# Altium project TCC.PrjPcb
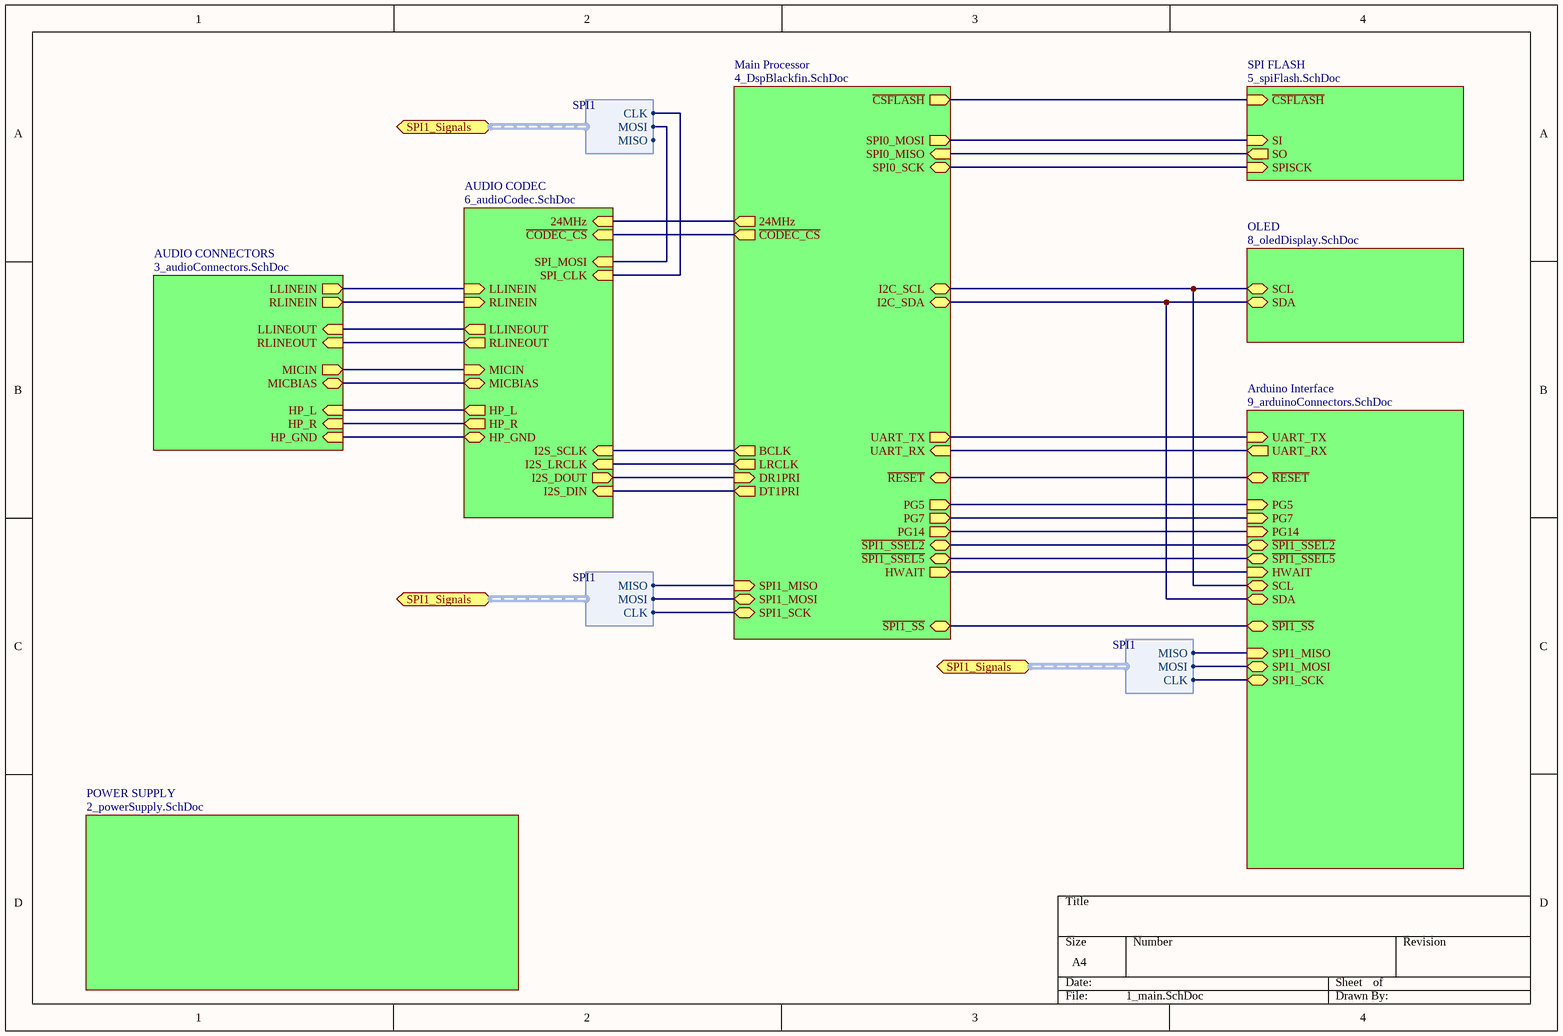
[diagram p0: 1_main.SchDoc]
8 sheets, 99 parts. Net scope: hierarchical (ports join the sheet entries above them; power ports are global).
Board file: PCB1.PcbDoc
Sheets:
  1_main.SchDoc
    Main Processor = 4_DspBlackfin.SchDoc
    SPI FLASH = 5_spiFlash.SchDoc
    OLED = 8_oledDisplay.SchDoc
    Arduino Interface = 9_arduinoConnectors.SchDoc
    AUDIO CODEC = 6_audioCodec.SchDoc
    AUDIO CONNECTORS = 3_audioConnectors.SchDoc
    POWER SUPPLY = 2_powerSupply.SchDoc

## Sheet 1_main.SchDoc
size A4

### Sub-sheets
Arduino Interface = 9_arduinoConnectors.SchDoc: PG7 (in), UART_TX (in), ~{SPI1_SS} (bidir), SPI1_SCK (bidir), ~{RESET} (bidir), ~{SPI1_SSEL5} (bidir), PG14 (in), PG5 (in), SPI1_MISO (in), SDA (bidir), SPI1_MOSI (bidir), ~{SPI1_SSEL2} (bidir), SCL (bidir), UART_RX (out), HWAIT (in)
AUDIO CODEC = 6_audioCodec.SchDoc: LLINEIN (in), LLINEOUT (out), RLINEIN (in), RLINEOUT (out), MICIN (in), MICBIAS (bidir), HP_R (out), HP_L (out), HP_GND (bidir), SPI_MOSI (in), SPI_CLK (in), I2S_DIN (in), I2S_SCLK (in), I2S_LRCLK (in), 24MHz (in), I2S_DOUT (out), ~{CODEC_CS} (in)
AUDIO CONNECTORS = 3_audioConnectors.SchDoc: LLINEIN (out), LLINEOUT (in), HP_R (in), RLINEOUT (in), HP_GND (in), MICIN (out), RLINEIN (out), HP_L (in), MICBIAS (bidir)
Main Processor = 4_DspBlackfin.SchDoc: SPI0_MISO (in), ~{CSFLASH} (out), SPI0_MOSI (out), SPI0_SCK (bidir), I2C_SDA (bidir), I2C_SCL (bidir), BCLK (out), DT1PRI (out), LRCLK (out), DR1PRI (in), SPI1_MOSI (bidir), SPI1_SCK (bidir), SPI1_MISO (in), 24MHz (out), ~{CODEC_CS} (out), UART_TX (out), UART_RX (in), ~{RESET} (bidir), ~{SPI1_SSEL5} (bidir), ~{SPI1_SSEL2} (bidir), PG5 (out), PG14 (out), PG7 (out), ~{SPI1_SS} (bidir), HWAIT (out)
OLED = 8_oledDisplay.SchDoc: SCL (bidir), SDA (bidir)
POWER SUPPLY = 2_powerSupply.SchDoc: no entries
SPI FLASH = 5_spiFlash.SchDoc: ~{CSFLASH} (in), SI (in), SO (out), SPISCK (in)

### Ports
SPI1_Signals (harness SPI1)

### Harnesses
SPI1: MISO, MOSI, CLK
SPI1: MOSI, CLK, MISO

### Nets
LLINEIN: sheet AUDIO CODEC/LLINEIN, sheet AUDIO CONNECTORS/LLINEIN
LLINEOUT: sheet AUDIO CODEC/LLINEOUT, sheet AUDIO CONNECTORS/LLINEOUT
RLINEIN: sheet AUDIO CODEC/RLINEIN, sheet AUDIO CONNECTORS/RLINEIN
RLINEOUT: sheet AUDIO CODEC/RLINEOUT, sheet AUDIO CONNECTORS/RLINEOUT
NetC14_2: sheet AUDIO CODEC/MICIN, sheet AUDIO CONNECTORS/MICIN
NetC15_2: sheet AUDIO CODEC/MICBIAS, sheet AUDIO CONNECTORS/MICBIAS
NetCN4_1: sheet AUDIO CODEC/HP_GND, sheet AUDIO CONNECTORS/HP_GND
NetCN4_3: sheet AUDIO CODEC/HP_R, sheet AUDIO CONNECTORS/HP_R
NetCN4_5: sheet AUDIO CODEC/HP_L, sheet AUDIO CONNECTORS/HP_L
NetCN7_3: sheet Main Processor/PG5, sheet Arduino Interface/PG5
NetCN7_4: sheet Main Processor/PG14, sheet Arduino Interface/PG14
NetCN7_5: sheet Main Processor/PG7, sheet Arduino Interface/PG7
NetCN8_1: sheet Main Processor/HWAIT, sheet Arduino Interface/HWAIT
NetP2_1: sheet Main Processor/I2C_SCL, sheet OLED/SCL, sheet Arduino Interface/SCL
NetP2_2: sheet Main Processor/I2C_SDA, sheet OLED/SDA, sheet Arduino Interface/SDA
NetP2_5: sheet Main Processor/SPI1_SCK, sheet Arduino Interface/SPI1_SCK, sheet AUDIO CODEC/SPI_CLK, port SPI1_Signals.CLK
NetP2_6: sheet Main Processor/SPI1_MISO, sheet Arduino Interface/SPI1_MISO, port SPI1_Signals.MISO
NetP2_7: sheet Main Processor/SPI1_MOSI, sheet Arduino Interface/SPI1_MOSI, sheet AUDIO CODEC/SPI_MOSI, port SPI1_Signals.MOSI
NetP2_8: sheet Main Processor/~{SPI1_SSEL2}, sheet Arduino Interface/~{SPI1_SSEL2}
NetP2_9: sheet Main Processor/~{SPI1_SSEL5}, sheet Arduino Interface/~{SPI1_SSEL5}
NetP2_10: sheet Main Processor/~{SPI1_SS}, sheet Arduino Interface/~{SPI1_SS}
NetR8_2: sheet Main Processor/24MHz, sheet AUDIO CODEC/24MHz
NetR21_1: sheet Main Processor/~{RESET}, sheet Arduino Interface/~{RESET}
NetR24_1: sheet Main Processor/SPI0_MISO, sheet SPI FLASH/SO
NetR25_1: sheet Main Processor/~{CSFLASH}, sheet SPI FLASH/~{CSFLASH}
NetR26_2: sheet Main Processor/SPI0_SCK, sheet SPI FLASH/SPISCK
NetR31_2: sheet Main Processor/UART_RX, sheet Arduino Interface/UART_RX
NetR32_2: sheet Main Processor/UART_TX, sheet Arduino Interface/UART_TX
NetU3_1: sheet Main Processor/BCLK, sheet AUDIO CODEC/I2S_SCLK
NetU3_2: sheet Main Processor/LRCLK, sheet AUDIO CODEC/I2S_LRCLK
NetU3_5: sheet Main Processor/DT1PRI, sheet AUDIO CODEC/I2S_DIN
NetU3_11: sheet Main Processor/~{CODEC_CS}, sheet AUDIO CODEC/~{CODEC_CS}
NetU3_16: sheet Main Processor/SPI0_MOSI, sheet SPI FLASH/SI
NetU3_64: sheet Main Processor/DR1PRI, sheet AUDIO CODEC/I2S_DOUT

## Sheet 4_DspBlackfin.SchDoc
size A3; DocumentNumber: 6; SheetNumber: 6; SheetTotal: 8
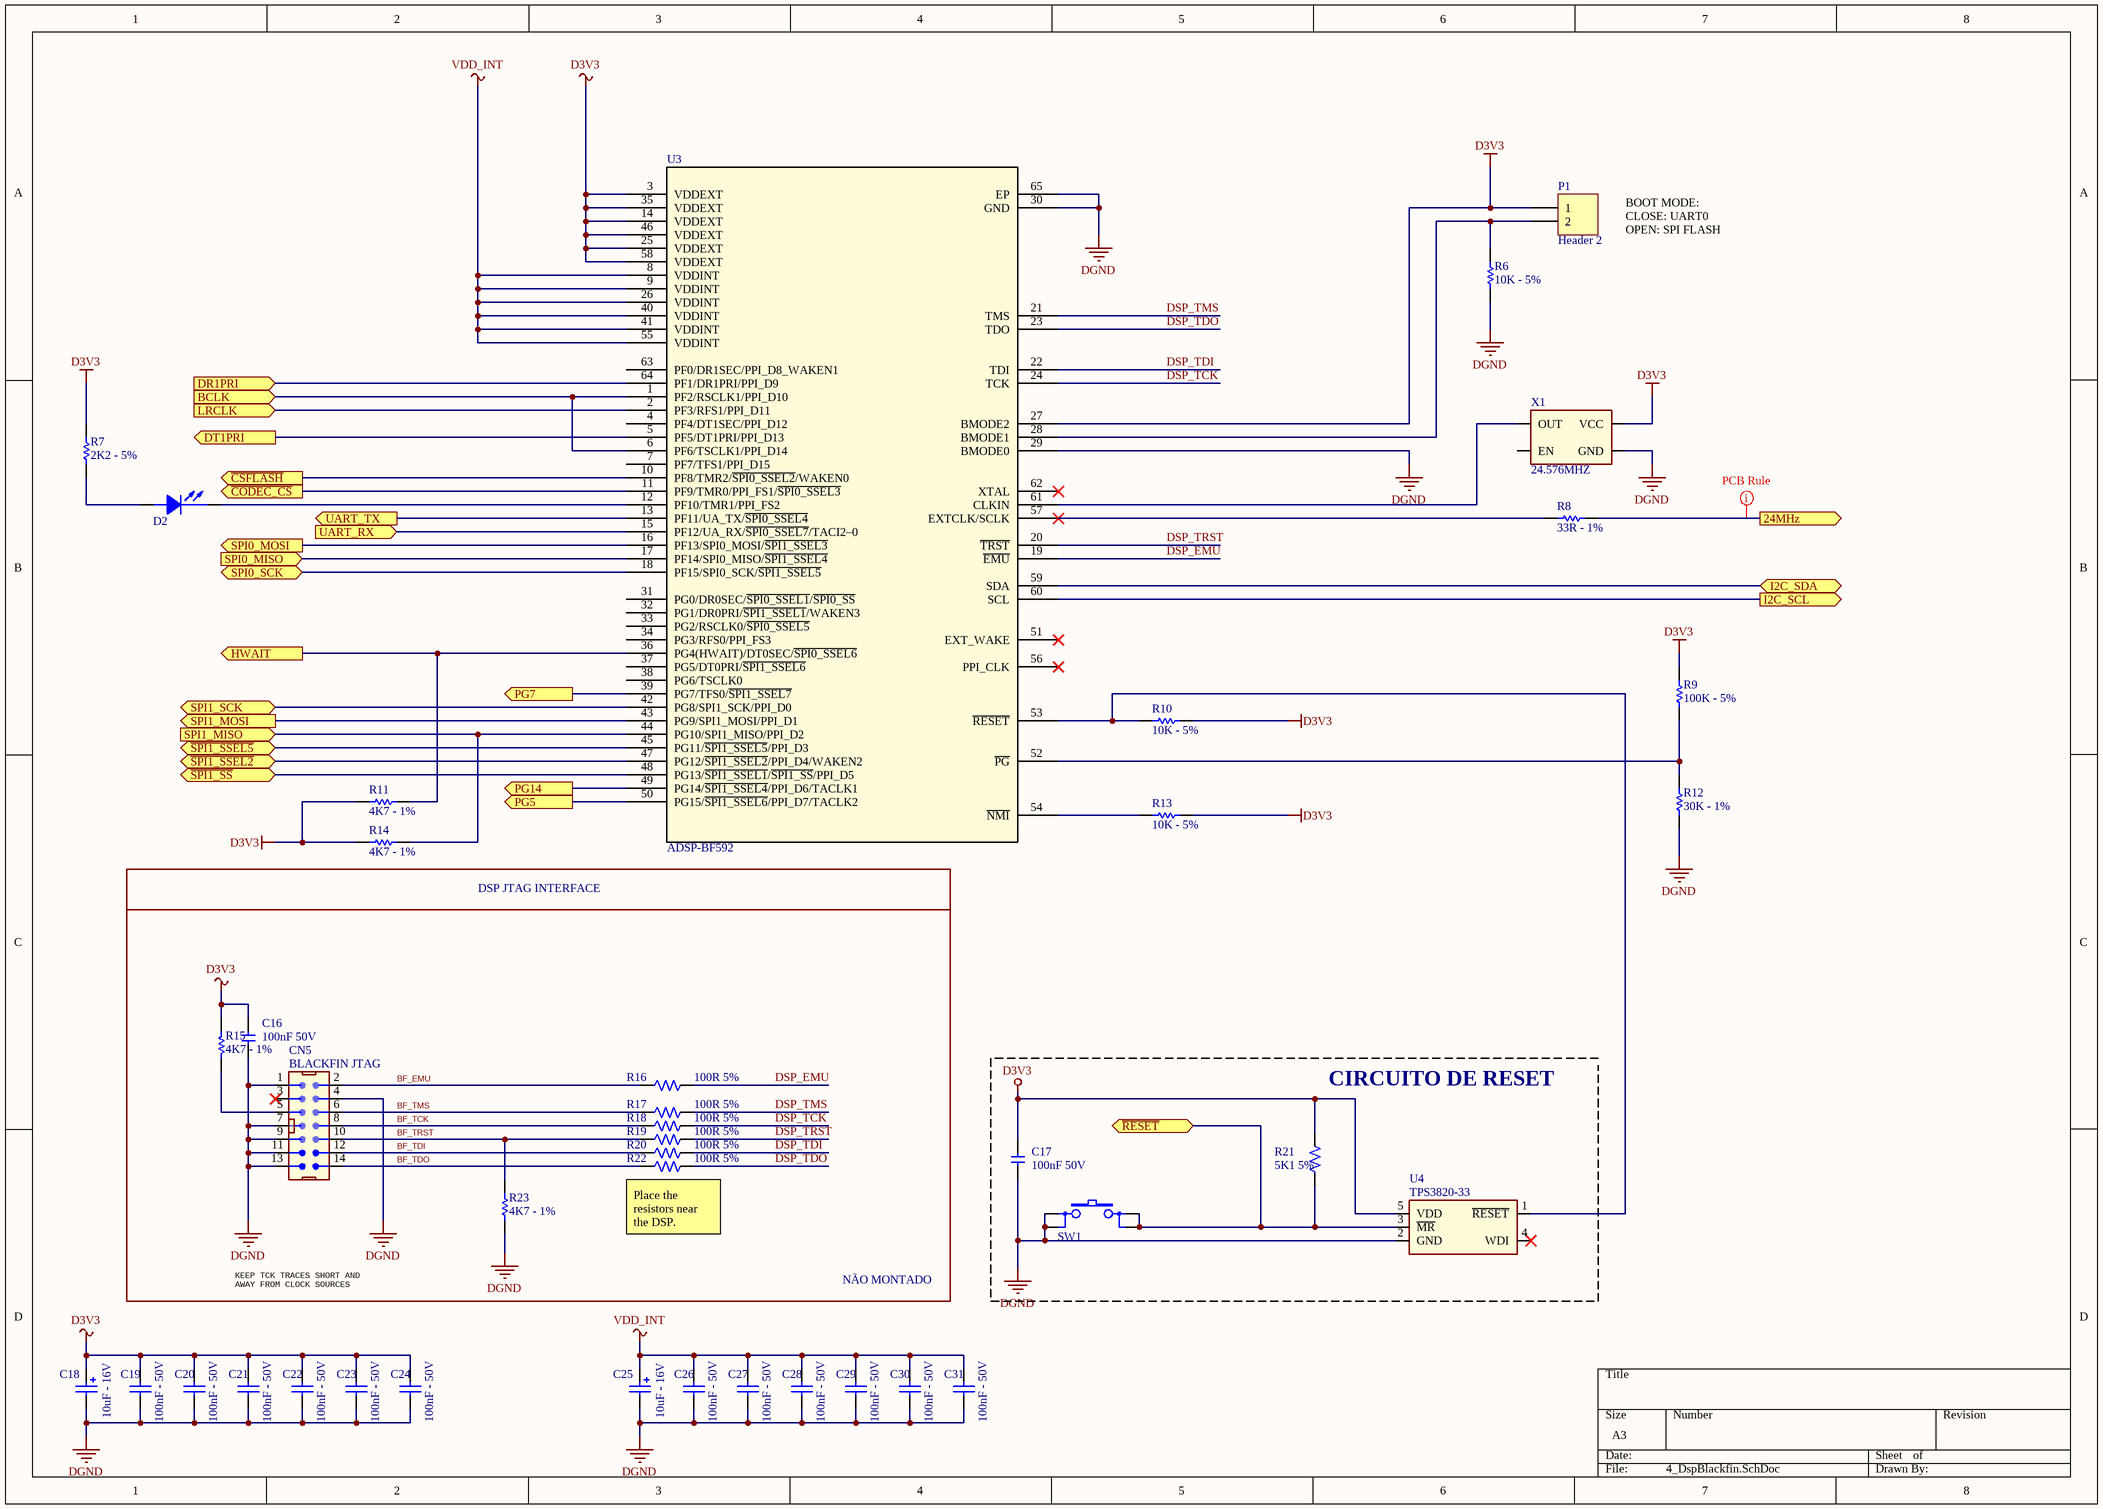
[diagram p1: 4_DspBlackfin.SchDoc]

### Parts
C16  100nF 50V  [SMD0805]
C17  100nF 50V  [SMD0805]
C18  VALOR: 10uF - 16V  [CAP/SMD/ELET/5MM/NP]  (hidden comment: Capacitor 10 uF - 20%)
C19  VALOR: 100nF - 50V  [SMD0805-CAP]  (hidden comment: Capacitor 100 nF - 10%)
C20  VALOR: 100nF - 50V  [SMD0805-CAP]  (hidden comment: Capacitor 100 nF - 10%)
C21  VALOR: 100nF - 50V  [SMD0805-CAP]  (hidden comment: Capacitor 100 nF - 10%)
C22  VALOR: 100nF - 50V  [SMD0805-CAP]  (hidden comment: Capacitor 100 nF - 10%)
C23  VALOR: 100nF - 50V  [SMD0805-CAP]  (hidden comment: Capacitor 100 nF - 10%)
C24  VALOR: 100nF - 50V  [SMD0805-CAP]  (hidden comment: Capacitor 100 nF - 10%)
C25  VALOR: 10uF - 16V  [CAP/SMD/ELET/5MM/NP]  (hidden comment: Capacitor 10 uF - 20%)
C26  VALOR: 100nF - 50V  [SMD0805-CAP]  (hidden comment: Capacitor 100 nF - 10%)
C27  VALOR: 100nF - 50V  [SMD0805-CAP]  (hidden comment: Capacitor 100 nF - 10%)
C28  VALOR: 100nF - 50V  [SMD0805-CAP]  (hidden comment: Capacitor 100 nF - 10%)
C29  VALOR: 100nF - 50V  [SMD0805-CAP]  (hidden comment: Capacitor 100 nF - 10%)
C30  VALOR: 100nF - 50V  [SMD0805-CAP]  (hidden comment: Capacitor 100 nF - 10%)
C31  VALOR: 100nF - 50V  [SMD0805-CAP]  (hidden comment: Capacitor 100 nF - 10%)
CN5  BLACKFIN JTAG  [WALCON.100/IDSC14/W.325/14]
D2  LED 2MM SMD AZUL  [LED\SMD1206]  (value not drawn)
P1  Header 2  [HDR1X2]
R6  VALOR: 10K - 5%  [SMD0805]  (hidden comment: 10K - 5% - 0805 - 328)
R7  VALOR: 2K2 - 5%  [SMD0805]  (hidden comment: 2K2 - 5% - 0805 - 333)
R8  VALOR: 33R - 1%  [SMD0805]  (hidden comment: 33R - 1% - 0805 - 406)
R9  VALOR: 100K - 5%  [SMD0805]  (hidden comment: 100K - 5% - 0805 - 326)
R10  VALOR: 10K - 5%  [SMD0805]  (hidden comment: 10K - 5% - 0805 - 328)
R11  VALOR: 4K7 - 1%  [SMD0805]  (hidden comment: 4K7 - 1% - 0805 - 438)
R12  VALOR: 30K - 1%  [SMD0805]  (hidden comment: 30K- 1% - 0805 - 400)
R13  VALOR: 10K - 5%  [SMD0805]  (hidden comment: 10K - 5% - 0805 - 328)
R14  VALOR: 4K7 - 1%  [SMD0805]  (hidden comment: 4K7 - 1% - 0805 - 438)
R15  VALOR: 4K7 - 1%  [SMD0805]  (hidden comment: 4K7 - 1% - 0805 - 438)
R16  100R 5%  [SMD0805]
R17  100R 5%  [SMD0805]
R18  100R 5%  [SMD0805]
R19  100R 5%  [SMD0805]
R20  100R 5%  [SMD0805]
R21  5K1 5%  [SMD0805]
R22  100R 5%  [SMD0805]
R23  VALOR: 4K7 - 1%  [SMD0805]  (hidden comment: 4K7 - 1% - 0805 - 438)
SW1  Switch TACT, 180G, 4 TERM, 6 X 6MM  [SW/TACT]  (value not drawn)
U3  ADSP-BF592  [CP_64_4]
U4  TPS3820-33  [DBV.95M/5/WG3.00/L3.00]
X1  VALOR: 24.576MHZ  [CRYSTAL/SMD/5X7]  (hidden comment: Crystal 24.576MHZ)

### Ports
24MHz (out), BCLK (in), DR1PRI (in), DT1PRI (out), HWAIT (out), I2C_SCL (out), I2C_SDA (bidir), LRCLK (in), PG5 (out), PG7 (out), PG14 (out), SPI0_MISO (in), SPI0_MOSI (out), SPI0_SCK (bidir), SPI1_MISO (in), SPI1_MOSI (out), SPI1_SCK (bidir), UART_RX (in), UART_TX (out), ~{CODEC_CS} (out), ~{CSFLASH} (out), ~{RESET} (bidir), ~{SPI1_SSEL2} (bidir), ~{SPI1_SSEL5} (bidir), ~{SPI1_SS} (bidir)

### Nets
D3V3: C16.2 C17.2 C18.1 C19.2 C20.1 C21.1 C22.2 C23.2 C24.2 P1.1 R7.2 R9.2 R10.2 R11.2 R13.2 R14.2 R15.2 R21.2 U3.3(VDDEXT) U3.14(VDDEXT) U3.25(VDDEXT) U3.27(BMODE2) U3.35(VDDEXT) U3.46(VDDEXT) U3.58(VDDEXT) U4.5(VDD) X1.4(VCC)
DGND: C16.1 C17.1 C18.2 C19.1 C20.2 C21.2 C22.1 C23.1 C24.1 C25.2 C26.1 C27.2 C28.2 C29.1 C30.1 C31.1 CN5.1 CN5.4 CN5.7 CN5.9 CN5.11 CN5.13 R6.1 R12.1 R23.1 SW1.1 SW1.2 U3.29(BMODE0) U3.30(GND) U3.65(EP) U4.2(GND) X1.2(GND)
VDD_INT: C25.1 C26.2 C27.1 C28.1 C29.2 C30.2 C31.2 U3.8(VDDINT) U3.9(VDDINT) U3.26(VDDINT) U3.40(VDDINT) U3.41(VDDINT) U3.55(VDDINT)
BF_EMU: CN5.2 R16.1
BF_TCK: CN5.8 R18.1
BF_TDI: CN5.12 R20.1
BF_TDO: CN5.14 R22.1
BF_TMS: CN5.6 R17.1
BF_TRST: CN5.10 R19.1 R23.2
DSP_EMU: R16.2 U3.19(~{EMU})
DSP_TCK: R18.2 U3.24(TCK)
DSP_TDI: R20.2 U3.22(TDI)
DSP_TDO: R22.2 U3.23(TDO)
DSP_TMS: R17.2 U3.21(TMS)
DSP_TRST: R19.2 U3.20(~{TRST})
NetCN5_5: CN5.5 R15.1
NetCN7_3: U3.50(PG15/~{SPI1_SSEL6}/PPI_D7/TACLK2) ; port PG5
NetCN7_4: U3.49(PG14/~{SPI1_SSEL4}/PPI_D6/TACLK1) ; port PG14
NetCN7_5: U3.39(PG7/TFS0/~{SPI1_SSEL7}) ; port PG7
NetCN8_1: R11.1 U3.36(PG4(HWAIT)/DT0SEC/~{SPI0_SSEL6}) ; port HWAIT
NetD2_1: D2.1(ANODE) R7.1
NetD2_2: D2.2(CATHODE) U3.12(PF10/TMR1/PPI_FS2)
NetP1_2: P1.2 R6.2 U3.28(BMODE1)
NetP2_1: U3.60(SCL) ; port I2C_SCL
NetP2_2: U3.59(SDA) ; port I2C_SDA
NetP2_5: U3.42(PG8/SPI1_SCK/PPI_D0) ; port SPI1_SCK
NetP2_6: R14.1 U3.44(PG10/SPI1_MISO/PPI_D2) ; port SPI1_MISO
NetP2_7: U3.43(PG9/SPI1_MOSI/PPI_D1) ; port SPI1_MOSI
NetP2_8: U3.47(PG12/~{SPI1_SSEL2}/PPI_D4/WAKEN2) ; port ~{SPI1_SSEL2}
NetP2_9: U3.45(PG11/~{SPI1_SSEL5}/PPI_D3) ; port ~{SPI1_SSEL5}
NetP2_10: U3.48(PG13/~{SPI1_SSEL1}/~{SPI1_SS}/PPI_D5) ; port ~{SPI1_SS}
NetR8_1: R8.1 U3.57(EXTCLK/SCLK)
NetR8_2: R8.2 ; port 24MHz
NetR9_1: R9.1 R12.2 U3.52(~{PG})
NetR10_1: R10.1 U3.53(~{RESET}) U4.1(~{RESET})
NetR13_1: R13.1 U3.54(~{NMI})
NetR21_1: R21.1 SW1.3 SW1.4 U4.3(~{MR}) ; port ~{RESET}
NetR24_1: U3.17(PF14/SPI0_MISO/~{SPI1_SSEL4}) ; port SPI0_MISO
NetR25_1: U3.10(PF8/TMR2/~{SPI0_SSEL2}/WAKEN0) ; port ~{CSFLASH}
NetR26_2: U3.18(PF15/SPI0_SCK/~{SPI1_SSEL5}) ; port SPI0_SCK
NetR31_2: U3.15(PF12/UA_RX/~{SPI0_SSEL7}/TACI2–0) ; port UART_RX
NetR32_2: U3.13(PF11/UA_TX/~{SPI0_SSEL4}) ; port UART_TX
NetU3_1: U3.1(PF2/RSCLK1/PPI_D10) U3.6(PF6/TSCLK1/PPI_D14) ; port BCLK
NetU3_2: U3.2(PF3/RFS1/PPI_D11) ; port LRCLK
NetU3_5: U3.5(PF5/DT1PRI/PPI_D13) ; port DT1PRI
NetU3_11: U3.11(PF9/TMR0/PPI_FS1/~{SPI0_SSEL3}) ; port ~{CODEC_CS}
NetU3_16: U3.16(PF13/SPI0_MOSI/~{SPI1_SSEL3}) ; port SPI0_MOSI
NetU3_61: U3.61(CLKIN) X1.3(OUT)
NetU3_64: U3.64(PF1/DR1PRI/PPI_D9) ; port DR1PRI

Not connected (* = marked no-connect by the designer): CN5 3*; U3 4(PF4/DT1SEC/PPI_D12) 7(PF7/TFS1/PPI_D15) 31(PG0/DR0SEC/~{SPI0_SSEL1}/~{SPI0_SS}) 32(PG1/DR0PRI/~{SPI1_SSEL1}/WAKEN3) 33(PG2/RSCLK0/~{SPI0_SSEL5}) 34(PG3/RFS0/PPI_FS3) 37(PG5/DT0PRI/~{SPI1_SSEL6}) 38(PG6/TSCLK0) 51(EXT_WAKE)* 56(PPI_CLK)* 62(XTAL)* 63(PF0/DR1SEC/PPI_D8_WAKEN1); U4 4(WDI)*; X1 1(EN)

### Layout directives
rule Undefined; Impedance: 50: NetR8_2

### Notes on the sheet
- BOOT MODE:
  CLOSE: UART0
  OPEN: SPI FLASH
- DSP JTAG INTERFACE
- CIRCUITO DE RESET
- (near R22) Place the resistors near the DSP.
- KEEP TCK TRACES SHORT AND
  AWAY FROM CLOCK SOURCES
- NÃO MONTADO

### Library data of the parts
C16 = 100nF 50V Z 0805 CCM 1760: MANUFACTURER: AVX; PARTNUMBER: 08055G104ZAT2A; CODE: 1760; DESC: CAP 100nF, 50V, SMD0805, Z%, Y5V, CERAMICO MULTICAMADA; VOLTAGE: CMAX; PSpiceTemplate: C^@REFDES %1 %2 ?TOLERANCE|C^@REFDES| @VALUE ?IC/IC=@IC/ ?TOLERANCE|\n.model C^@REFDES CAP C=1 DEV=@TOLERANCE%|; COMPSIDE: TOP; COMPLOC: [712.500,1512.500]; COMPROT: 90; COMPGROUP: 0; COMPFIXED: NO; COMPHEIGHT: 0.000; Value: 100nF 50V; COMPLOCKED: NO; COMPKEY: NO; DECOUPLER: NO; MEMORY: NO
C17 = 100nF 50V Z 0805 CCM 1760: MANUFACTURER: AVX; PARTNUMBER: 08055G104ZAT2A; CODE: 1760; DESC: CAP 100nF, 50V, SMD0805, Z%, Y5V, CERAMICO MULTICAMADA; VOLTAGE: CMAX; PSpiceTemplate: C^@REFDES %1 %2 ?TOLERANCE|C^@REFDES| @VALUE ?IC/IC=@IC/ ?TOLERANCE|\n.model C^@REFDES CAP C=1 DEV=@TOLERANCE%|; COMPSIDE: TOP; COMPLOC: [9537.500,4387.500]; COMPROT: 270; COMPGROUP: 0; COMPFIXED: NO; COMPHEIGHT: 0.000; Value: 100nF 50V; COMPLOCKED: NO; COMPKEY: NO; DECOUPLER: NO; MEMORY: NO
C18 C25 = 10uF - 16V - 20% - 5x11 - 3052: Capacitor 10uF, 20%, SMD 0805 5mm D x 5.8mm L; MANUFACTURER: NICHICON; PARTNUMBER: UUP1C100MCL1GS; CODIGO: 3052; EMBALAGEM: RELL; FORNECEDOR: VARIOS; DESC: CAP 10uF, 16V, C 5 X 11, ELCO SMD, NON POLARIZED; ComponentLink1Description: Datasheet; ComponentLink1URL: http://www.mouser.com/ds/2/293/e-up-27686.pdf; ComponentLink2Description: HOME NICHICON; ComponentLink2URL: http://nichicon-us.com/english/index.html; ENCAPSULAMENTO: CAP/SMD/ELET/5MM/NP; FACTORY PACK: 1000; LOCALIZAÇÃO: *; Supplier 1: Mouser; Supplier Part Number 1: 647-UUP1C100MCL1GS
C19-C24 C26-C31 = 100nF - 50V - 10% - 0805 - 580: Capacitor 100nF, 10%, SMD 0805; MANUFACTURER: AVX; PARTNUMBER: 08055C104KAT2A; CODIGO: 580; EMBALAGEM: REEL; FORNECEDOR: VARIOS; DESC: CAP 100nF, 50V, SMD0805, 10%, X7R, CERAMICO MULTICAMADA; TARGET MÁX U$: $0,0041; ComponentLink1Description: Datasheet; ComponentLink1URL: http://www.avx.com/docs/catalogs/cx7r.pdf; ComponentLink2Description: HOME AVX; ComponentLink2URL: http://www.avx.com/; ENCAPSULAMENTO: SMD0805; FACTORY PACK: 4000; LOCALIZAÇÃO: *; Supplier 1: Mouser; Supplier Part Number 1: 08055C104KAT2A; NCM: 8532.21.11
CN5 = IDC BOX HEADER 14P 762: PARTNUMBER: IDCSC-14; MANUFACTURER: METALTEX; DESC: CNC PCI, IDC BOX HEADER, 14P, 180G, SEM EJETOR; CODE: 762; COMPHEIGHT: 0.000; MEMORY: NO; COMPGROUP: 0; COMPROT: 270; COMPLOC: [212.500,1475.000]; COMPSIDE: TOP; DECOUPLER: NO; COMPKEY: NO; COMPLOCKED: NO; COMPFIXED: NO
D2 = LED 2MM SMD1206 AZUL - 3220: MANUFACTURER: DIALIGHT; PARTNUMBER: 598-8291-107F; DESC: LED 2MM, SMD1206, AZUL, 90MCD, 140G, DIFUSO; CODIGO: 3220; EMBALAGEM: REEL; ENCAPSULAMENTO: LED SMD; FORNECEDOR: MOUSER; ComponentLinK1Description: Datasheet; ComponentLink1URL: http://media.digikey.com/pdf/Data%20Sheets/Dialight%20PDFs/598_Series_1206_Pkg.pdf; ComponentLink2Description: HOME DIALIGHT; ComponentLink2URL: www.dialight.com; FACTORY PACK: 3000; LOCALIZAÇÃO: *; VALOR: LED 2MM SMD AZUL; Supplier Part Number 1: 645-598-8291-107F
P1 = Header 2: Header, 2-Pin; LatestRevisionDate: 17-Jul-2002; LatestRevisionNote: Re-released for DXP Platform.; Publisher: Altium Limited
R6 R10 R13 = 10K - 5% - 0805 - 328: Resistor 10K, 5%, SMD 0805; PARTNUMBER: RC2012J103CS; MANUFACTURER: SAMSUNG; CODIGO: 328; EMBALAGEM: REEL; FORNECEDOR: VARIOS; DESC: RES 10K, 5%, SMD 0805, MF; TARGET MÁX U$: $0.0012; ENCAPSULAMENTO: SMD0805; FACTORY PACK: 5000; ComponentLink1URL: http://media.digikey.com/pdf/Data%20Sheets/Samsung%20PDFs/CHIP_RESISTOR_Catalog.pdf; ComponentLink1Description: Datasheet; ComponentLink2Description: HOME SANSUNG; ComponentLink2URL: http://www.samsung.com/global/business/semiconductor/; Supplier 1: Digi-Key; Supplier Part Number 1: 1276-5552-1-ND; NCM: 8533.21.20
R7 = 2K2 - 5% - 0805 - 333: Resistor 2K2, 5%, SMD 0805; PARTNUMBER: RC2012J222CS; MANUFACTURER: SAMSUNG; CODIGO: 333; EMBALAGEM: REEL; FORNECEDOR: VARIOS; DESC: RES 2K2, 5%, SMD 0805, MF; TARGET MÁX U$: $0.0015; LOCALIZAÇÃO: *; ENCAPSULAMENTO: SMD0805; FACTORY PACK: 5000; Supplier 1: AVNET; Supplier Part Number 1: RC2012J222CS; ComponentLink1Description: Datasheet; ComponentLink1URL: http://download.siliconexpert.com/pdfs/2011/2/28/4/59/40/979/sam_/manual/resistor-general1.pdf; ComponentLink2Description: HOME SAMSUNG; ComponentLink2URL: http://www.samsung.com/global/business/semiconductor/; NCM: 8533.21.20
R8 = 33R - 1% - 0805 - 406: Resistor 33R 1%, SMD 0805; PARTNUMBER: RC2012F33R0CS; MANUFACTURER: SAMSUNG; CODIGO: 406; EMBALAGEM: REEL; FORNECEDOR: VARIOS; DESC: RES 33R, 1%, SMD 0805, MF; TARGET MÁX U$: $0.0015; LOCALIZAÇÃO: *; ENCAPSULAMENTO: SMD0805; FACTORY PACK: 5000; ComponentLink1Description: Datasheet; ComponentLink1URL: http://download.siliconexpert.com/pdfs/2013/2/17/18/59/11/464/koa_/manual/104rk73h.pdf; ComponentLink2Description: KOA Speer Electronics webpage; ComponentLink2URL: http://www.koaspeer.com/; Supplier 1: MOUSER; Supplier Part Number 1: RC2012F33R0CS; NCM: 8533.21.20
R9 = 100K - 5% - 0805 - 326: Resistor 100K, 5%, SMD 0805; PARTNUMBER: RC2012J104CS; MANUFACTURER: SAMSUNG; CODIGO: 326; EMBALAGEM: REEL; FORNECEDOR: VARIOS; DESC: RES 100K, 5%, SMD 0805, MF; TARGET MÁX U$: $0.0012; LOCALIZAÇÃO: *; ENCAPSULAMENTO: SMD0805; FACTORY PACK: 5000; ComponentLink1Description: Datasheet; ComponentLink1URL: http://media.digikey.com/pdf/Data%20Sheets/Samsung%20PDFs/CHIP_RESISTOR_Catalog.pdf; ComponentLink2Description: HOME SANSUNG; ComponentLink2URL: http://www.samsung.com/global/business/semiconductor/; Supplier 1: Digi-Key; Supplier Part Number 1: 1276-5576-1-ND; NCM: 8533.21.20
R11 R14 R23 = 4K7 - 1% - 0805 - 438: Resistor 4K7, 1%, SMD 0805; PARTNUMBER: RC2012F4701CS; MANUFACTURER: SAMSUNG; CODIGO: 438; EMBALAGEM: REEL; FORNECEDOR: VARIOS; DESC: RES 4K7, 1%, SMD 0805, MF; TARGET MÁX U$: $0.0015; LOCALIZAÇÃO: *; ENCAPSULAMENTO: SMD0805; FACTORY PACK: 5000; ComponentLink1Description: Datasheet; ComponentLink1URL: http://avnetexpress.avnet.com/store/em/EMController/_/A-5002847207733/An-0?action=part&catalogId=500201&langId=-1&storeId=500201&CMP=KNC-SupplyFrame_VSE-T11; ComponentLink2Description: HOME SAMSUNG; ComponentLink2URL: http://www.samsung.com/global/business/semiconductor/; Supplier 1: AVNET; Supplier Part Number 1: RC2012F4701CS; NCM: 8533.21.20
R12 = 30K - 1% - 0805 - 401: Resistor 30K, 1%, SMD 0805; PARTNUMBER: ERJ-6ENF3002V; MANUFACTURER: Vishay Dale; CODIGO: 401; EMBALAGEM: REEL; FORNECEDOR: VARIOS; DESC: RES 30K, 1%, SMD 0805, MF; TARGET MÁX U$: $0.0015; LOCALIZAÇÃO: *; ENCAPSULAMENTO: SMD0805; FACTORY PACK: 5000; ComponentLink1Description: Datasheet; ComponentLink1URL: http://www.vishay.com/docs/20035/dcrcwe3.pdf; ComponentLink2Description: Vishay Homepage; ComponentLink2URL: http://www.vishay.com/; Supplier 1: AVNET; Supplier Part Number 1: CRCW0805300RFKEA; NCM: 8533.21.20
R15 = 4K7 - 1% - 0805 - 438: Resistor 4K7, 1%, SMD 0805; PARTNUMBER: RC2012F4701CS; MANUFACTURER: SAMSUNG; DESC: RES 4K7, 1%, SMD 0805, MF; CODIGO: 438; EMBALAGEM: REEL; FORNECEDOR: VARIOS; TARGET MÁX U$: $0.0015; LOCALIZAÇÃO: *; ENCAPSULAMENTO: SMD0805; FACTORY PACK: 5000; ComponentLink1Description: Datasheet; ComponentLink1URL: http://avnetexpress.avnet.com/store/em/EMController/_/A-5002847207733/An-0?action=part&catalogId=500201&langId=-1&storeId=500201&CMP=KNC-SupplyFrame_VSE-T11; ComponentLink2Description: HOME SAMSUNG; ComponentLink2URL: http://www.samsung.com/global/business/semiconductor/; Supplier 1: AVNET; Supplier Part Number 1: RC2012F4701CS; NCM: 8533.21.20
R16 = 100R 5% 0805 327: MANUFACTURER: SAMSUNG; PARTNUMBER: RC2012J101CS; CODE: 327; DESC: RES 100R, 5%, SMD 0805, MF; COMPFIXED: NO; COMPGROUP: 0; COMPHEIGHT: 0.000; COMPLOC: [800.000,787.500]; COMPROT: 90; COMPSIDE: TOP; COMPKEY: NO; COMPLOCKED: NO; DECOUPLER: NO; MEMORY: NO
R17 = 100R 5% 0805 327: MANUFACTURER: SAMSUNG; PARTNUMBER: RC2012J101CS; CODE: 327; DESC: RES 100R, 5%, SMD 0805, MF; COMPFIXED: NO; COMPGROUP: 0; COMPHEIGHT: 0.000; COMPLOC: [875.000,887.500]; COMPROT: 270; COMPSIDE: TOP; COMPKEY: NO; COMPLOCKED: NO; DECOUPLER: NO; MEMORY: NO
R18 = 100R 5% 0805 327: MANUFACTURER: SAMSUNG; PARTNUMBER: RC2012J101CS; CODE: 327; DESC: RES 100R, 5%, SMD 0805, MF; COMPFIXED: NO; COMPGROUP: 0; COMPHEIGHT: 0.000; COMPLOC: [562.500,1512.500]; COMPROT: 90; COMPSIDE: TOP; COMPKEY: NO; COMPLOCKED: NO; DECOUPLER: NO; MEMORY: NO
R19 = 100R 5% 0805 327: MANUFACTURER: SAMSUNG; PARTNUMBER: RC2012J101CS; CODE: 327; DESC: RES 100R, 5%, SMD 0805, MF; COMPFIXED: NO; COMPGROUP: 0; COMPHEIGHT: 0.000; COMPLOC: [650.000,887.500]; COMPROT: 270; COMPSIDE: TOP; COMPKEY: NO; COMPLOCKED: NO; DECOUPLER: NO; MEMORY: NO
R20 = 100R 5% 0805 327: MANUFACTURER: SAMSUNG; PARTNUMBER: RC2012J101CS; CODE: 327; DESC: RES 100R, 5%, SMD 0805, MF; COMPFIXED: NO; COMPGROUP: 0; COMPHEIGHT: 0.000; COMPLOC: [500.000,887.500]; COMPROT: 270; COMPSIDE: TOP; COMPKEY: NO; COMPLOCKED: NO; DECOUPLER: NO; MEMORY: NO
R21 = 5K1 5% 0805 1368: MANUFACTURER: SAMSUNG; PARTNUMBER: RC2012J512CS; CODE: 1368; DESC: RES 5K1, 5%, SMD 0805, MF; COMPSIDE: TOP; COMPLOC: [9775.000,4462.500]; COMPROT: 180; COMPGROUP: 0; COMPFIXED: NO; COMPHEIGHT: 0.000; COMPLOCKED: NO; COMPKEY: NO; DECOUPLER: NO; MEMORY: NO
R22 = 100R 5% 0805 327: MANUFACTURER: SAMSUNG; PARTNUMBER: RC2012J101CS; CODE: 327; DESC: RES 100R, 5%, SMD 0805, MF; COMPFIXED: NO; COMPGROUP: 0; COMPHEIGHT: 0.000; COMPLOC: [575.000,787.500]; COMPROT: 90; COMPSIDE: TOP; COMPKEY: NO; COMPLOCKED: NO; DECOUPLER: NO; MEMORY: NO
SW1 = Switch TACT 9.5mm - 1224: MANUFACTURER: METALTEX; PARTNUMBER: A06-9.5; DESC: CHAVE TACT, 180G, 4 TERM, 6 X 6MM, 9.5MM; CODIGO: 1224; VALOR: TACT, 180G, 4 TERM, 6 X 6MM; ComponentLinK1Description: Datasheet; ComponentLink1URL: *; ComponentLink2Description: HOME METALTEX; ComponentLink2URL: www.metaltex.com.br; EMBALAGEM: *; ENCAPSULAMENTO: *; FACTORY PACK: *; FORNECEDOR: METALTEX; LOCALIZAÇÃO: *
U3 = ADSP-BF592BCPZ: Imported; Value: ADSP-BF592; Type: Type; RefDes: RefDes
U4 = TPS3820-33 (SOT23) 3494: MANUFACTURER: TEXAS INSTRUMENTS; PARTNUMBER: TPS3820-33DBVR; DESC: TPS3820-33DBVR, PROCESSOR SUPERVISORY CIRCUITS, DBV, SOT-23; CODE: 3494; COMPFIXED: NO; COMPGROUP: 0; COMPHEIGHT: 10.000; COMPLOC: [9775.000,4300.000]; COMPROT: 180; COMPSIDE: TOP; COMPKEY: NO; COMPLOCKED: NO; DECOUPLER: NO; MEMORY: NO
X1 = Crystal 24.576MHZ 20PPM SMD - 3063: PARTNUMBER: ASV-24.576MHZ-EJ-T; MANUFACTURER: ABRACON; CODIGO: 3063; DESC: OSCILADOR, SMD 5 X 7MM, 3.3V, 20PPM, 24.576MHZ; EMBALAGEM: REEL; ENCAPSULAMENTO: SMD; FORNECEDOR: MOUSER; ComponentLinK1Description: Datasheet; ComponentLink1URL: http://www.mouser.com/ds/2/3/ASV-24925.pdf; ComponentLink2Description: HOME ABRACON; ComponentLink2URL: www.abracon.com; FACTORY PACK: 1000; LOCALIZAÇÃO: *; Supplier 1: Mouser; Supplier Part Number 1: 815-ASV-24.576-EJ-T

## Sheet 5_spiFlash.SchDoc
size A4
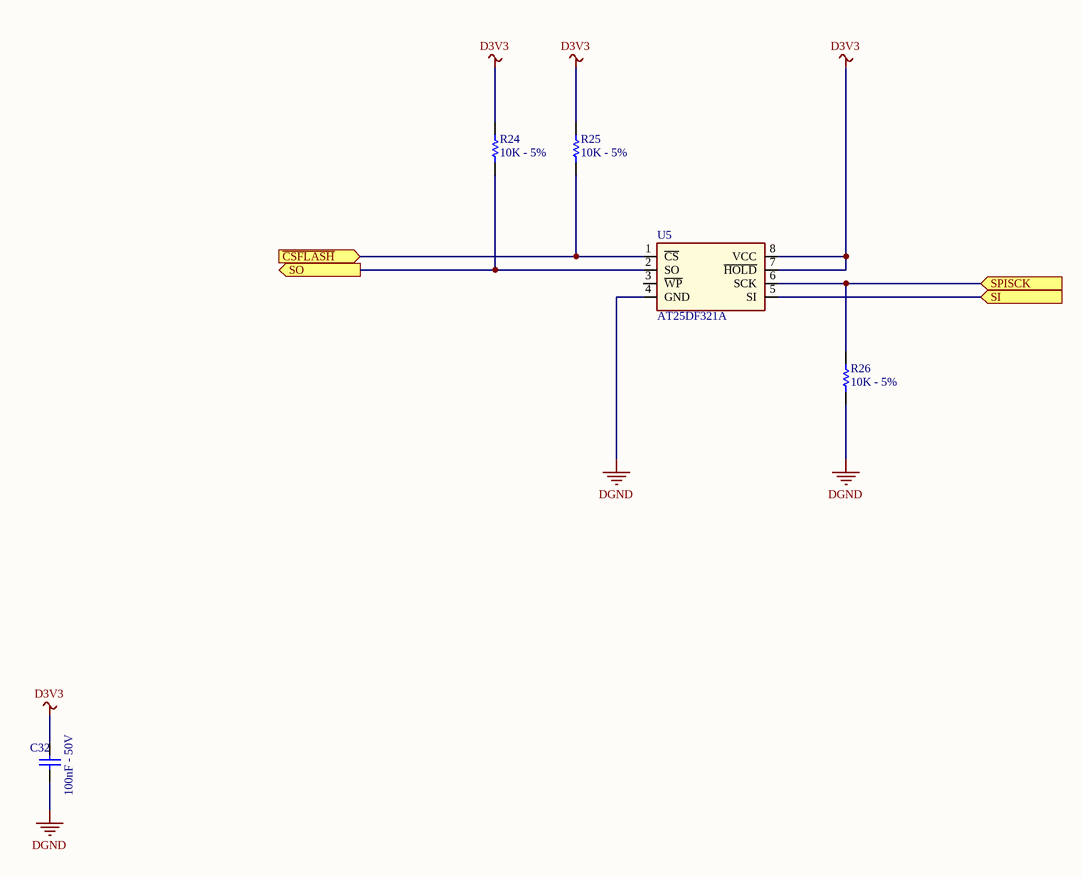
[diagram p2: 5_spiFlash.SchDoc]

### Parts
C32  VALOR: 100nF - 50V  [SMD0805-CAP]  (hidden comment: Capacitor 100 nF - 10%)
R24  VALOR: 10K - 5%  [SMD0805]  (hidden comment: 10K - 5% - 0805 - 328)
R25  VALOR: 10K - 5%  [SMD0805]  (hidden comment: 10K - 5% - 0805 - 328)
R26  VALOR: 10K - 5%  [SMD0805]  (hidden comment: 10K - 5% - 0805 - 328)
U5  VALOR: AT25DF321A  [BIQUAD.SOG.050/8/WG.325/L.200]  (hidden comment: AT25DF321A (EIAJ SOIC) 5219)

### Ports
SI (in), SO (out), SPISCK (in), ~{CSFLASH} (in)

### Nets
D3V3: C32.1 R24.2 R25.2 U5.7(~{HOLD}) U5.8(VCC)
DGND: C32.2 R26.1 U5.4(GND)
NetR24_1: R24.1 U5.2(SO) ; port SO
NetR25_1: R25.1 U5.1(~{CS}) ; port ~{CSFLASH}
NetR26_2: R26.2 U5.6(SCK) ; port SPISCK
NetU3_16: U5.5(SI) ; port SI

Not connected (* = marked no-connect by the designer): U5 3(~{WP})

### Library data of the parts
C32 = 100nF - 50V - 10% - 0805 - 580: as C19 on sheet 4_DspBlackfin; ComponentLink1Description: Datasheet; ComponentLink1URL: http://www.avx.com/docs/catalogs/cx7r.pdf; ComponentLink2Description: HOME AVX; ComponentLink2URL: http://www.avx.com/; ENCAPSULAMENTO: SMD0805; FACTORY PACK: 4000; LOCALIZAÇÃO: *; Supplier 1: Mouser; Supplier Part Number 1: 08055C104KAT2A; NCM: 8532.21.11
R24-R26 = 10K - 5% - 0805 - 328: as R6 on sheet 4_DspBlackfin; ENCAPSULAMENTO: SMD0805; FACTORY PACK: 5000; ComponentLink1URL: http://media.digikey.com/pdf/Data%20Sheets/Samsung%20PDFs/CHIP_RESISTOR_Catalog.pdf; ComponentLink1Description: Datasheet; ComponentLink2Description: HOME SANSUNG; ComponentLink2URL: http://www.samsung.com/global/business/semiconductor/; Supplier 1: Digi-Key; Supplier Part Number 1: 1276-5552-1-ND; NCM: 8533.21.20
U5 = AT25DF321A (EIAJ SOIC) 5219: CI AT25DF321A; MANUFACTURER: ATMEL; CODIGO: 5219; DESC: CI, AT25DF321A-SH-T, 32M/2.7V INTERFACE SERIAL FLASH, SOIC-8; EMBALAGEM: REEL; ENCAPSULAMENTO: SOIC8; FORNECEDOR: VARIOS; TARGET MÁX U$: $1,0000; PARTNUMBER: AT25DF321A; Supplier 1: VERICAL; Supplier Part Number 1: AT25DF321A-SH-B; ComponentLink1URL: http://www.mouser.com/ds/2/590/doc3686-219632.pdf; ComponentLinK1Description: Datasheet; ComponentLink2Description: HOME Adesto; ComponentLink2URL: http://www.adestotech.com/; FACTORY PACK: 2000; LOCALIZAÇÃO: *; NCM: 8542.31.20

## Sheet 8_oledDisplay.SchDoc
size A4
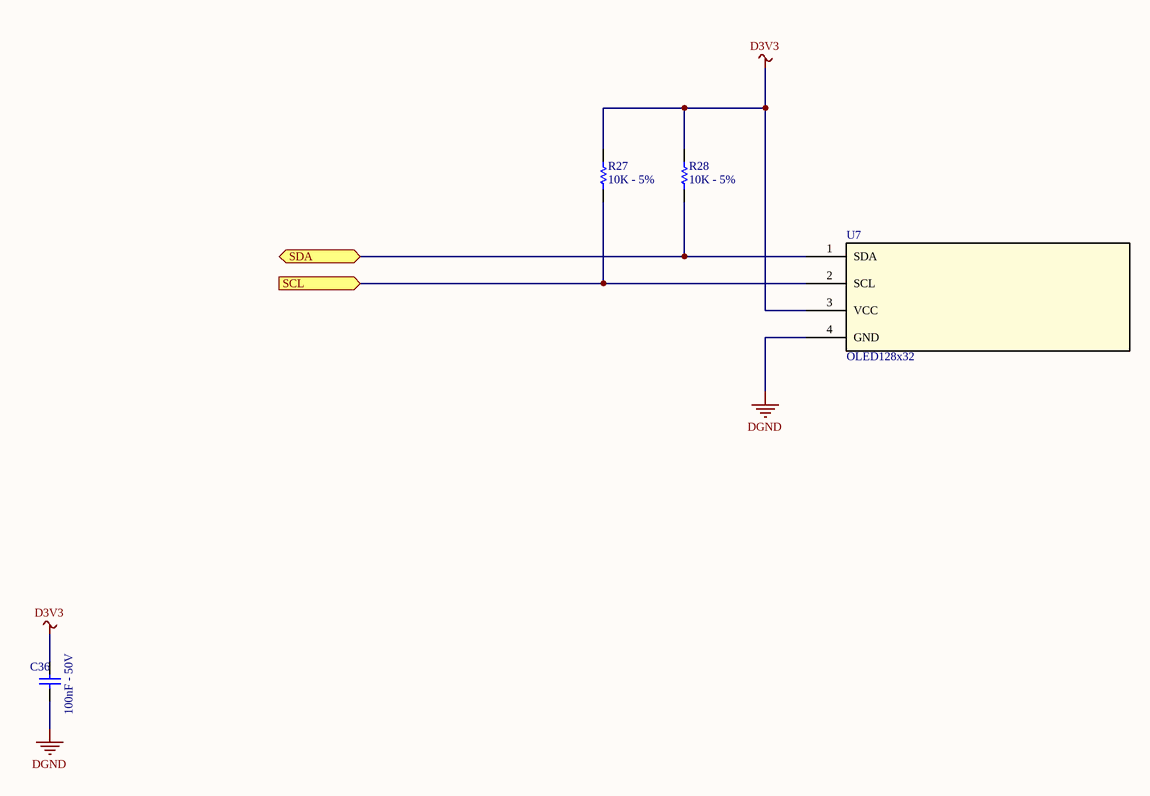
[diagram p3: 8_oledDisplay.SchDoc]

### Parts
C36  VALOR: 100nF - 50V  [SMD0805-CAP]  (hidden comment: Capacitor 100 nF - 10%)
R27  VALOR: 10K - 5%  [SMD0805]  (hidden comment: 10K - 5% - 0805 - 328)
R28  VALOR: 10K - 5%  [SMD0805]  (hidden comment: 10K - 5% - 0805 - 328)
U7  OLED128x32  [OLEDGREATZT128x32]

### Ports
SCL (in), SDA (bidir)

### Nets
D3V3: C36.1 R27.2 R28.2 U7.3(VCC)
DGND: C36.2 U7.4(GND)
NetP2_1: R27.1 U7.2(SCL) ; port SCL
NetP2_2: R28.1 U7.1(SDA) ; port SDA

### Library data of the parts
C36 = 100nF - 50V - 10% - 0805 - 580: as C19 on sheet 4_DspBlackfin; ComponentLink1Description: Datasheet; ComponentLink1URL: http://www.avx.com/docs/catalogs/cx7r.pdf; ComponentLink2Description: HOME AVX; ComponentLink2URL: http://www.avx.com/; ENCAPSULAMENTO: SMD0805; FACTORY PACK: 4000; LOCALIZAÇÃO: *; Supplier 1: Mouser; Supplier Part Number 1: 08055C104KAT2A; NCM: 8532.21.11
R27 R28 = 10K - 5% - 0805 - 328: as R6 on sheet 4_DspBlackfin; ENCAPSULAMENTO: SMD0805; FACTORY PACK: 5000; ComponentLink1URL: http://media.digikey.com/pdf/Data%20Sheets/Samsung%20PDFs/CHIP_RESISTOR_Catalog.pdf; ComponentLink1Description: Datasheet; ComponentLink2Description: HOME SANSUNG; ComponentLink2URL: http://www.samsung.com/global/business/semiconductor/; Supplier 1: Digi-Key; Supplier Part Number 1: 1276-5552-1-ND; NCM: 8533.21.20

## Sheet 9_arduinoConnectors.SchDoc
size A4
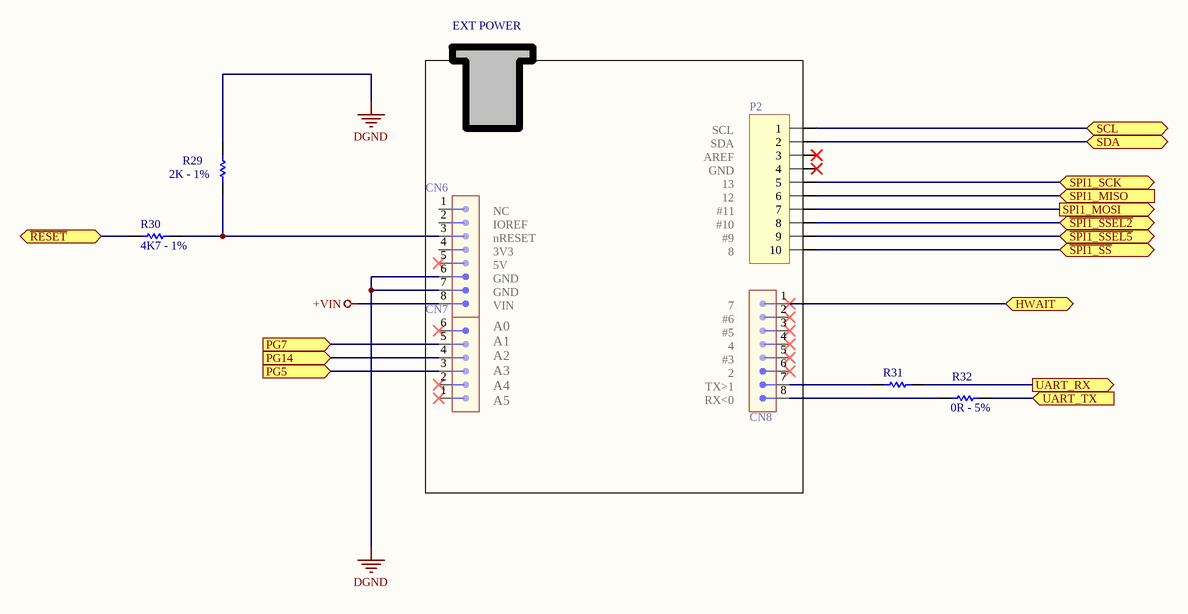
[diagram p4: 9_arduinoConnectors.SchDoc]

### Parts
CN6  Conector M HEADER, 180G, SIMPLES, 8P  [BLKCON.100/MCS-8/W.100/8]  (value not drawn)
CN7  Conector M HEADER, 180G, SIMPLES, 6P  [BLKCON.100/MCS-6/W.100/6]  (value not drawn)
CN8  Conector M HEADER, 180G, SIMPLES, 8P  [BLKCON.100/MCS-8/W.100/8]  (value not drawn)
P2  Header 10  [HDR1X10]  (value not drawn)
R29  VALOR: 2K - 1%  [SMD0805]  (hidden comment: 2K - 1% - 0805 - 392)
R30  VALOR: 4K7 - 1%  [SMD0805]  (hidden comment: 4K7 - 1% - 0805 - 438)
R31  0R - 5% - 0805 - 3365  [SMD0805]  (value not drawn)
R32  VALOR: 0R - 5%  [SMD0805]  (hidden comment: 0R - 5% - 0805 - 3365)

### Ports
HWAIT (bidir), PG5 (in), PG7 (in), PG14 (in), SCL (bidir), SDA (bidir), SPI1_MISO (in), SPI1_MOSI (out), SPI1_SCK (bidir), UART_RX (out), UART_TX (in), ~{RESET} (bidir), ~{SPI1_SSEL2} (bidir), ~{SPI1_SSEL5} (bidir), ~{SPI1_SS} (bidir)

### Nets
+VIN: CN6.8
DGND: CN6.6 CN6.7 R29.2
NetCN6_3: CN6.3 R29.1 R30.2
NetCN7_3: CN7.3 ; port PG5
NetCN7_4: CN7.4 ; port PG14
NetCN7_5: CN7.5 ; port PG7
NetCN8_1: CN8.1 ; port HWAIT
NetCN8_7: CN8.7 R31.1
NetCN8_8: CN8.8 R32.1
NetP2_1: P2.1 ; port SCL
NetP2_2: P2.2 ; port SDA
NetP2_5: P2.5 ; port SPI1_SCK
NetP2_6: P2.6 ; port SPI1_MISO
NetP2_7: P2.7 ; port SPI1_MOSI
NetP2_8: P2.8 ; port ~{SPI1_SSEL2}
NetP2_9: P2.9 ; port ~{SPI1_SSEL5}
NetP2_10: P2.10 ; port ~{SPI1_SS}
NetR21_1: R30.1 ; port ~{RESET}
NetR31_2: R31.2 ; port UART_RX
NetR32_2: R32.2 ; port UART_TX

Not connected (* = marked no-connect by the designer): CN6 1 2 4 5*; CN7 1* 2* 6*; CN8 2* 3* 4* 5* 6*; P2 3* 4*

### Notes on the sheet
- EXT POWER
- SCL
  SDA
  AREF
  GND
  13
  12
  #11
  #10
  #9
  8
- NC
  IOREF
  nRESET
  3V3
  5V
  GND
  GND
  VIN
- A0
  A1
  A2
  A3
  A4
  A5
- (near CN8) 7
  #6
  #5
  4
  #3
  2
  TX>1
  RX<0

### Library data of the parts
CN6 CN8 = CNC M HEADER, 180G, SIMPLES, 8P - 786: MANUFACTURER: METALTEX; PARTNUMBER: MCS-08; CODIGO: 786; DESC: CNC PCI, MINI HEADER SIMPLES, 8P, 180G, 2.54MM; VALOR: Conector M HEADER, 180G, SIMPLES, 8P; LOCALIZAÇÃO: *; FORNECEDOR: METALTEX; FACTORY PACK: *; ENCAPSULAMENTO: *; EMBALAGEM: *; ComponentLink2URL: www.metaltex.com.br; ComponentLink2Description: HOME METALTEX; ComponentLink1URL: *; ComponentLinK1Description: Datasheet; NCM: 8536.90.40
CN7 = CNC M HEADER, 180G, SIMPLES, 6P - 785: MANUFACTURER: METALTEX; PARTNUMBER: MCS-06; DESC: CNC PCI, MINI HEADER SIMPLES, 6P, 180G, 2.54MM; CODIGO: 785; VALOR: Conector M HEADER, 180G, SIMPLES, 6P; ComponentLinK1Description: Datasheet; ComponentLink1URL: *; ComponentLink2Description: HOME METALTEX; ComponentLink2URL: www.metaltex.com.br; EMBALAGEM: *; ENCAPSULAMENTO: *; FACTORY PACK: *; LOCALIZAÇÃO: *; FORNECEDOR: METALTEX; NCM: 8536.90.40
P2 = Header 10: Header, 10-Pin; LatestRevisionDate: 17-Jul-2002; LatestRevisionNote: Re-released for DXP Platform.; Publisher: Altium Limited
R29 = 2K - 1% - 0805 - 392: Resistor 2K, 1%, SMD 0805; PARTNUMBER: 0805W8F2001T5E; MANUFACTURER: SAMSUNG; CODIGO: 392; EMBALAGEM: REEL; FORNECEDOR: VARIOS; DESC: RES 2K, 1%, SMD 0805, MF; TARGET MÁX U$: $0.0015; LOCALIZAÇÃO: *; ENCAPSULAMENTO: SMD0805; FACTORY PACK: 5000; Supplier 1: AVNET; Supplier Part Number 1: 0805W8F2001T5E; ComponentLink1Description: Datasheet; ComponentLink1URL: http://download.siliconexpert.com/pdfs/2011/2/28/4/59/40/979/sam_/manual/resistor-general1.pdf; ComponentLink2Description: HOME SANSUNG; ComponentLink2URL: http://www.samsung.com/global/business/semiconductor/; NCM: 8533.21.20
R30 = 4K7 - 1% - 0805 - 438: as R11 on sheet 4_DspBlackfin; LOCALIZAÇÃO: *; ENCAPSULAMENTO: SMD0805; FACTORY PACK: 5000; ComponentLink1Description: Datasheet; ComponentLink1URL: http://avnetexpress.avnet.com/store/em/EMController/_/A-5002847207733/An-0?action=part&catalogId=500201&langId=-1&storeId=500201&CMP=KNC-SupplyFrame_VSE-T11; ComponentLink2Description: HOME SAMSUNG; ComponentLink2URL: http://www.samsung.com/global/business/semiconductor/; Supplier 1: AVNET; Supplier Part Number 1: RC2012F4701CS; NCM: 8533.21.20
R31 = 0R - 5% - 0805 - 3365: Resistor 0R, 5%, SMD 0805; PARTNUMBER: ERJ-6GEY0R00V; MANUFACTURER: PANASONIC; CODIGO: 3365; EMBALAGEM: REEL; FORNECEDOR: VARIOS; DESC: RES 0R, 5%, SMD 0805, MF; TARGET MÁX U$: $0.0012; VALOR: 0R - 5%; LOCALIZAÇÃO: *; ENCAPSULAMENTO: SMD0805; FACTORY PACK: 5.000; ComponentLink1Description: Datasheet; ComponentLink1URL: http://www.mouser.com/ds/2/315/AOA0000CE1-37422.pdf; ComponentLink2Description: HOME PANASONIC; ComponentLink2URL: http://www.panasonic.com/industrial/electronic-components/; Supplier 1: Mouser; Supplier Part Number 1: 667-ERJ-6GEY0R00V; NCM: 8533.21.20
R32 = 0R - 5% - 0805 - 3365: Resistor 0R, 5%, SMD 0805; PARTNUMBER: ERJ-6GEY0R00V; MANUFACTURER: PANASONIC; CODIGO: 3365; EMBALAGEM: REEL; FORNECEDOR: VARIOS; DESC: RES 0R, 5%, SMD 0805, MF; TARGET MÁX U$: $0.0012; LOCALIZAÇÃO: *; ENCAPSULAMENTO: SMD0805; FACTORY PACK: 5.000; ComponentLink1Description: Datasheet; ComponentLink1URL: http://www.mouser.com/ds/2/315/AOA0000CE1-37422.pdf; ComponentLink2Description: HOME PANASONIC; ComponentLink2URL: http://www.panasonic.com/industrial/electronic-components/; Supplier 1: Mouser; Supplier Part Number 1: 667-ERJ-6GEY0R00V; NCM: 8533.21.20

## Sheet 6_audioCodec.SchDoc
size A4
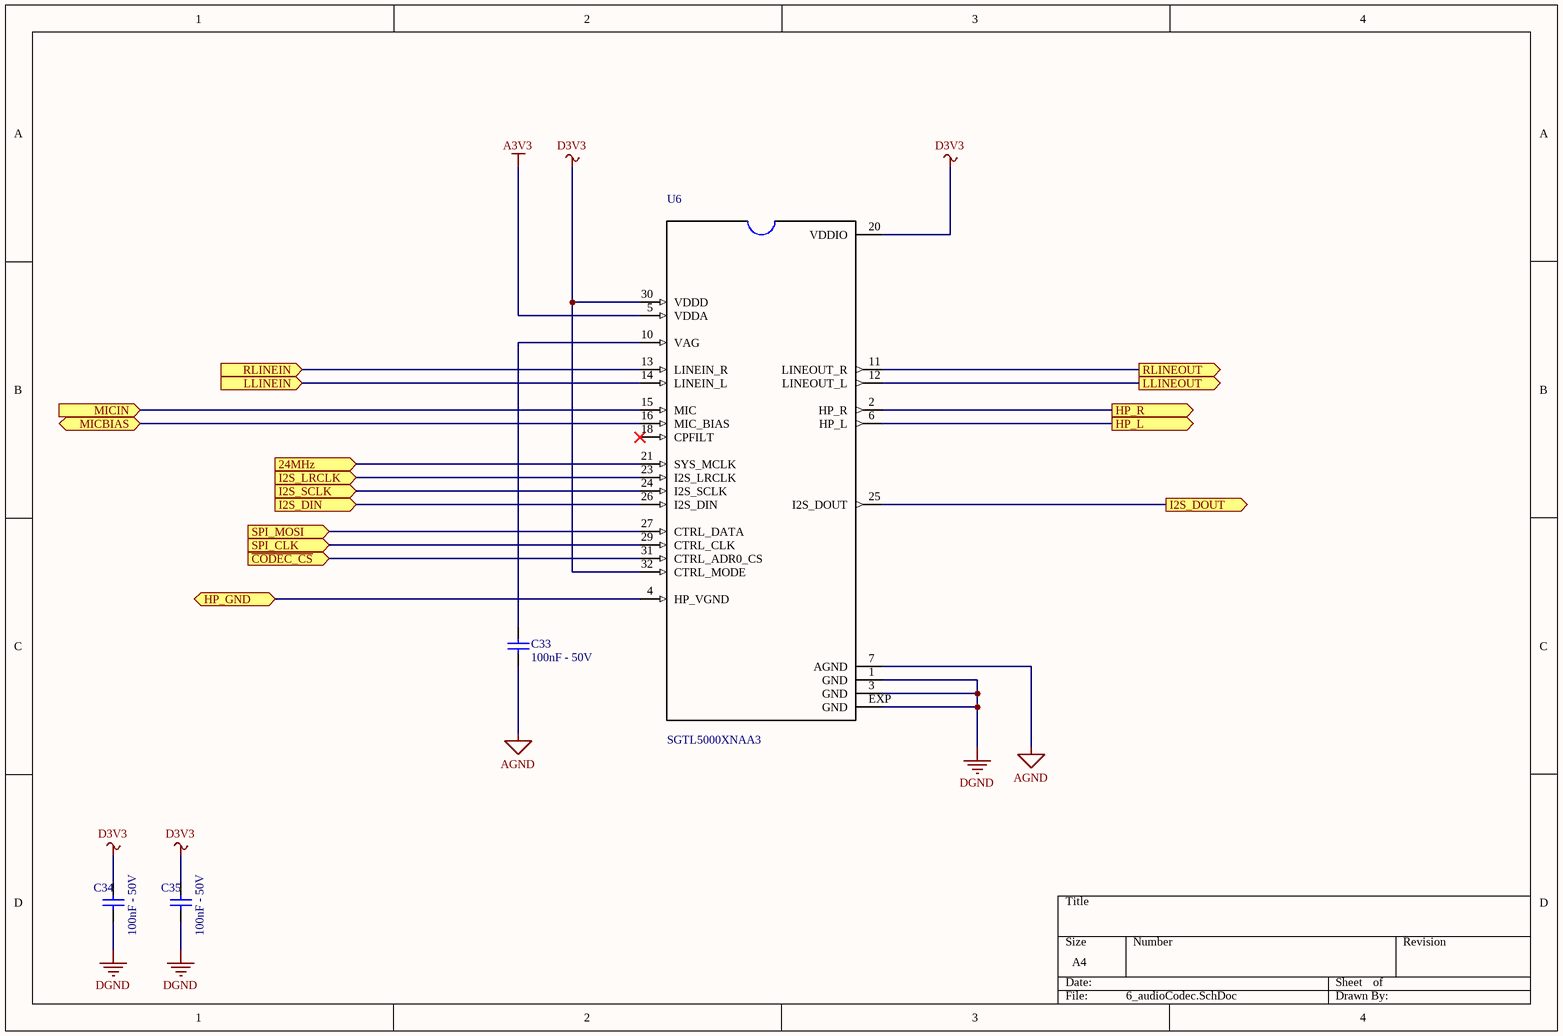
[diagram p5: 6_audioCodec.SchDoc]

### Parts
C33  VALOR: 100nF - 50V  [SMD0805-CAP]  (hidden comment: Capacitor 100 nF - 10%)
C34  VALOR: 100nF - 50V  [SMD0805-CAP]  (hidden comment: Capacitor 100 nF - 10%)
C35  VALOR: 100nF - 50V  [SMD0805-CAP]  (hidden comment: Capacitor 100 nF - 10%)
U6  SGTL5000XNAA3  [QFN50P500X500X100-33N_SGTL5000XNAA3(Primary)]

### Ports
24MHz (in), HP_GND (bidir), HP_L (out), HP_R (out), I2S_DIN (in), I2S_DOUT (out), I2S_LRCLK (in), I2S_SCLK (in), LLINEIN (in), LLINEOUT (out), MICBIAS (bidir), MICIN (in), RLINEIN (in), RLINEOUT (out), SPI_CLK (in), SPI_MOSI (in), ~{CODEC_CS} (in)

### Nets
A3V3: U6.5(VDDA)
AGND: C33.1 U6.7(AGND)
D3V3: C34.1 C35.1 U6.20(VDDIO) U6.30(VDDD) U6.32(CTRL_MODE)
DGND: C34.2 C35.2 U6.1(GND) U6.3(GND) U6.EXP(GND)
LLINEIN: U6.14(LINEIN_L) ; port LLINEIN
LLINEOUT: U6.12(LINEOUT_L) ; port LLINEOUT
RLINEIN: U6.13(LINEIN_R) ; port RLINEIN
RLINEOUT: U6.11(LINEOUT_R) ; port RLINEOUT
NetC14_2: U6.15(MIC) ; port MICIN
NetC15_2: U6.16(MIC_BIAS) ; port MICBIAS
NetC33_2: C33.2 U6.10(VAG)
NetCN4_1: U6.4(HP_VGND) ; port HP_GND
NetCN4_3: U6.2(HP_R) ; port HP_R
NetCN4_5: U6.6(HP_L) ; port HP_L
NetP2_5: U6.29(CTRL_CLK) ; port SPI_CLK
NetP2_7: U6.27(CTRL_DATA) ; port SPI_MOSI
NetR8_2: U6.21(SYS_MCLK) ; port 24MHz
NetU3_1: U6.24(I2S_SCLK) ; port I2S_SCLK
NetU3_2: U6.23(I2S_LRCLK) ; port I2S_LRCLK
NetU3_5: U6.26(I2S_DIN) ; port I2S_DIN
NetU3_11: U6.31(CTRL_ADR0_CS) ; port ~{CODEC_CS}
NetU3_64: U6.25(I2S_DOUT) ; port I2S_DOUT

Not connected (* = marked no-connect by the designer): U6 18(CPFILT)*

### Library data of the parts
C33-C35 = 100nF - 50V - 10% - 0805 - 580: as C19 on sheet 4_DspBlackfin; ComponentLink1Description: Datasheet; ComponentLink1URL: http://www.avx.com/docs/catalogs/cx7r.pdf; ComponentLink2Description: HOME AVX; ComponentLink2URL: http://www.avx.com/; ENCAPSULAMENTO: SMD0805; FACTORY PACK: 4000; LOCALIZAÇÃO: *; Supplier 1: Mouser; Supplier Part Number 1: 08055C104KAT2A; NCM: 8532.21.11
U6 = SGTL5000XNAA3: Audio Codec , Ultra Low-Power, 4 mw for DAC-to-HP, 98 dB SNR and -80 dB THD+N, QFN 32, Tray; MF: NXP Semiconductors; Package: QFN-32 NXP Semiconductors; MP: SGTL5000XNAA3; SnapEDA_Link: https://www.snapeda.com/parts/SGTL5000XNAA3/NXP%2520Semiconductors/view-part/?ref=snap; Availability: Good; Price: 2.26 USD; Value: *

## Sheet 3_audioConnectors.SchDoc
size A4
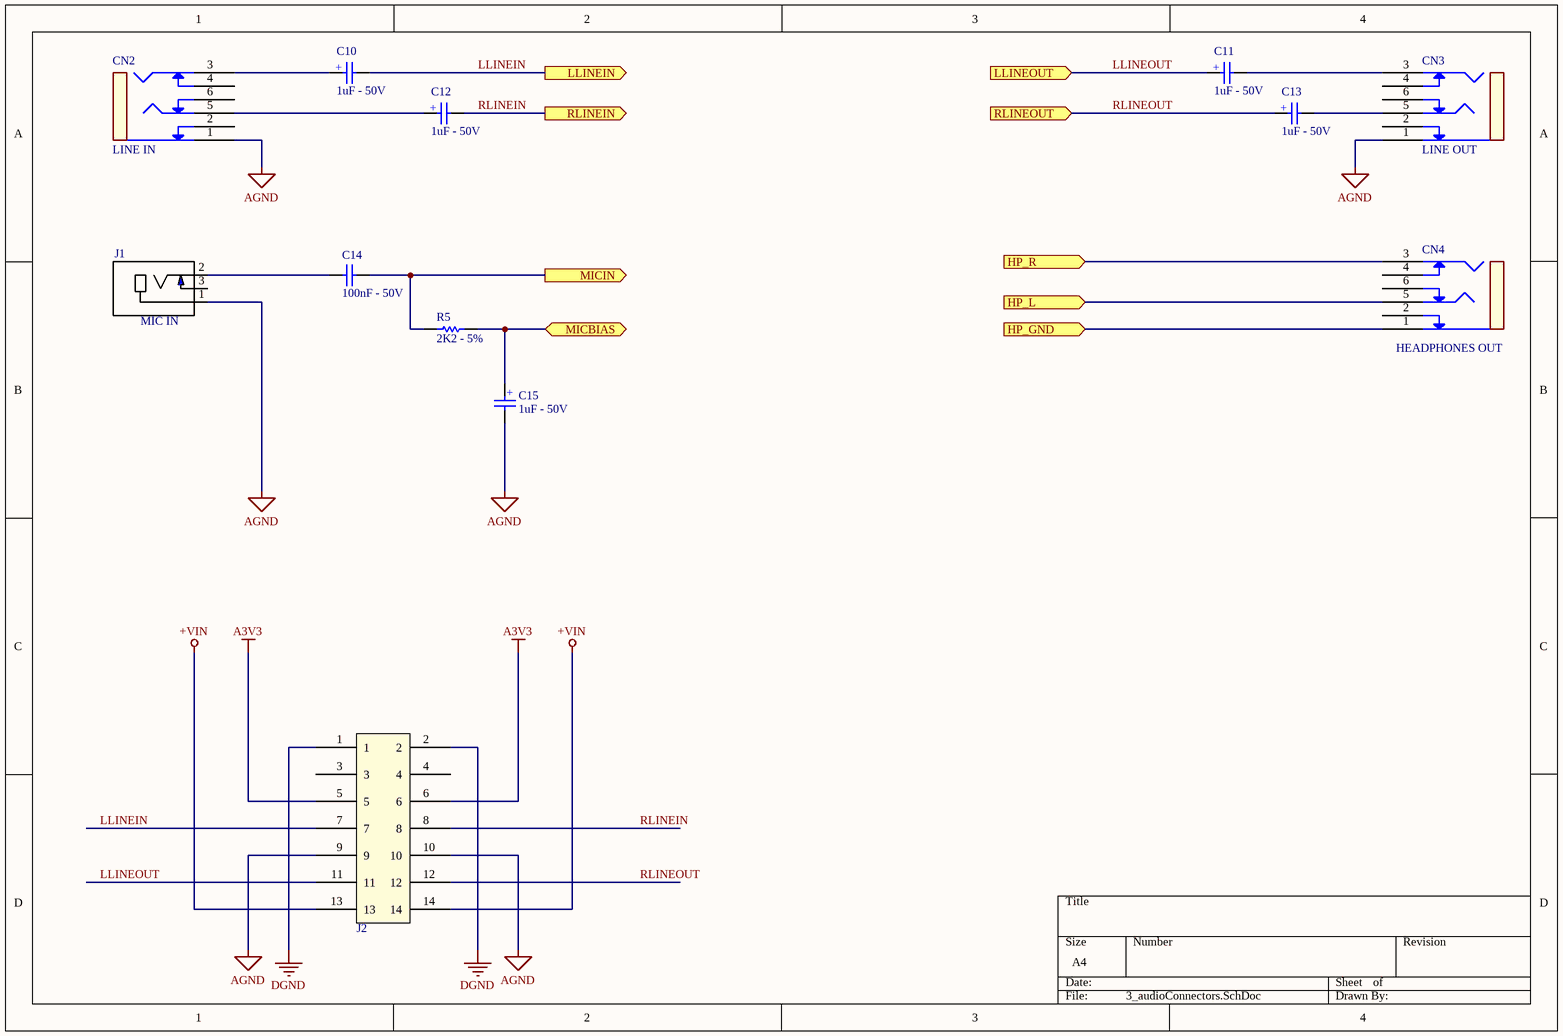
[diagram p6: 3_audioConnectors.SchDoc]

### Parts
C10  VALOR: 1uF - 50V  [CAP/SMD/ELET/5MM/NP]  (hidden comment: Capacitor 1 uF - 10%)
C11  VALOR: 1uF - 50V  [CAP/SMD/ELET/5MM/NP]  (hidden comment: Capacitor 1 uF - 10%)
C12  VALOR: 1uF - 50V  [CAP/SMD/ELET/5MM/NP]  (hidden comment: Capacitor 1 uF - 10%)
C13  VALOR: 1uF - 50V  [CAP/SMD/ELET/5MM/NP]  (hidden comment: Capacitor 1 uF - 10%)
C14  VALOR: 100nF - 50V  [SMD0805-CAP]  (hidden comment: Capacitor 100 nF - 10%)
C15  VALOR: 1uF - 50V  [CAP/SMD/ELET/5MM/NP]  (hidden comment: Capacitor 1 uF - 10%)
CN2  LINE IN  [CNC/P10/.080]
CN3  LINE OUT  [CNC/P10/.080]
CN4  HEADPHONES OUT  [CNC/P10/.080]
J1  value MIC IN  [CUI_MJ1-2510-SMT]  (hidden comment: MJ1-2510-SMT)
J2  BOARD SLOT CONNECTOR  [SLOT_CONN_BOARD]  (value not drawn)
R5  VALOR: 2K2 - 5%  [SMD0805]  (hidden comment: 2K2 - 5% - 0805 - 333)

### Ports
HP_GND (in), HP_L (in), HP_R (in), LLINEIN (out), LLINEOUT (in), MICBIAS (bidir), MICIN (out), RLINEIN (out), RLINEOUT (in)

### Nets
+VIN: J2.13 J2.14
A3V3: J2.5 J2.6
AGND: C15.1 CN2.1 CN3.1 J1.1 J2.9 J2.10
DGND: J2.1 J2.2
LLINEIN: C10.1 J2.7 ; port LLINEIN
LLINEOUT: C11.2 J2.11 ; port LLINEOUT
RLINEIN: C12.1 J2.8 ; port RLINEIN
RLINEOUT: C13.2 J2.12 ; port RLINEOUT
NetC10_2: C10.2 CN2.3
NetC11_1: C11.1 CN3.3
NetC12_2: C12.2 CN2.5
NetC13_1: C13.1 CN3.5
NetC14_1: C14.1 J1.2
NetC14_2: C14.2 R5.1 ; port MICIN
NetC15_2: C15.2 R5.2 ; port MICBIAS
NetCN4_1: CN4.1 ; port HP_GND
NetCN4_3: CN4.3 ; port HP_R
NetCN4_5: CN4.5 ; port HP_L

Not connected (* = marked no-connect by the designer): CN2 2 4 6; CN3 2 4 6; CN4 2 4 6; J1 3(4); J2 3 4

### Notes on the sheet
- (in symbol 1uF - 50V - 10% - 0805 - 3296) +

### Library data of the parts
C10-C13 C15 = 1uF - 50V - 10% - 0805 - 3296: Capacitor 1uF, 10%, SMD 0805; MANUFACTURER: AVX; PARTNUMBER: 08055C105KAT2A; CODIGO: 3296; EMBALAGEM: REEL; FORNECEDOR: VARIOS; DESC: CAP 1uF, 50V, SMD0805, 10%, X7R, CERAMICO MULTICAMADA; TARGET MÁX U$: $0,0507; ComponentLink1Description: Datasheet; ComponentLink1URL: http://www.tdk.com/pdf/general_B11.pdf; ComponentLink2Description: HOME TDK; ComponentLink2URL: http://www.tdk.com/; ENCAPSULAMENTO: SMD0805; FACTORY PACK: 3000; LOCALIZAÇÃO: *; Supplier 1: Mouser; Supplier Part Number 1: 08055C105KAT2A
C14 = 100nF - 50V - 10% - 0805 - 580: as C19 on sheet 4_DspBlackfin; ComponentLink1Description: Datasheet; ComponentLink1URL: http://www.avx.com/docs/catalogs/cx7r.pdf; ComponentLink2Description: HOME AVX; ComponentLink2URL: http://www.avx.com/; ENCAPSULAMENTO: SMD0805; FACTORY PACK: 4000; LOCALIZAÇÃO: *; Supplier 1: Mouser; Supplier Part Number 1: 08055C104KAT2A; NCM: 8532.21.11
CN2-CN4 = CNC JACK P10 ST P/ PCI, HORIZ, TP - 749: Conector JACK P10 ST P/ PC; DESC: CNC TRS 1/4", P10, JACK FEMEA, STEREO, HORIZONTAL, TP, P/ PCI, FE; CODIGO: 749; VALOR: Conector JACK P10 ST P/ PC; ComponentLinK1Description: Datasheet; ComponentLink1URL: *; ComponentLink2Description: *; ComponentLink2URL: *; EMBALAGEM: *; ENCAPSULAMENTO: *; FACTORY PACK: *; FORNECEDOR: *; LOCALIZAÇÃO: *; MANUFACTURER: *; PARTNUMBER: *; NCM: 8536.90.40
J2 = SLOT_MACHO: Conector de expansão colocado na borda da placa
R5 = 2K2 - 5% - 0805 - 333: as R7 on sheet 4_DspBlackfin; LOCALIZAÇÃO: *; ENCAPSULAMENTO: SMD0805; FACTORY PACK: 5000; Supplier 1: AVNET; Supplier Part Number 1: RC2012J222CS; ComponentLink1Description: Datasheet; ComponentLink1URL: http://download.siliconexpert.com/pdfs/2011/2/28/4/59/40/979/sam_/manual/resistor-general1.pdf; ComponentLink2Description: HOME SAMSUNG; ComponentLink2URL: http://www.samsung.com/global/business/semiconductor/; NCM: 8533.21.20

## Sheet 2_powerSupply.SchDoc
size A4
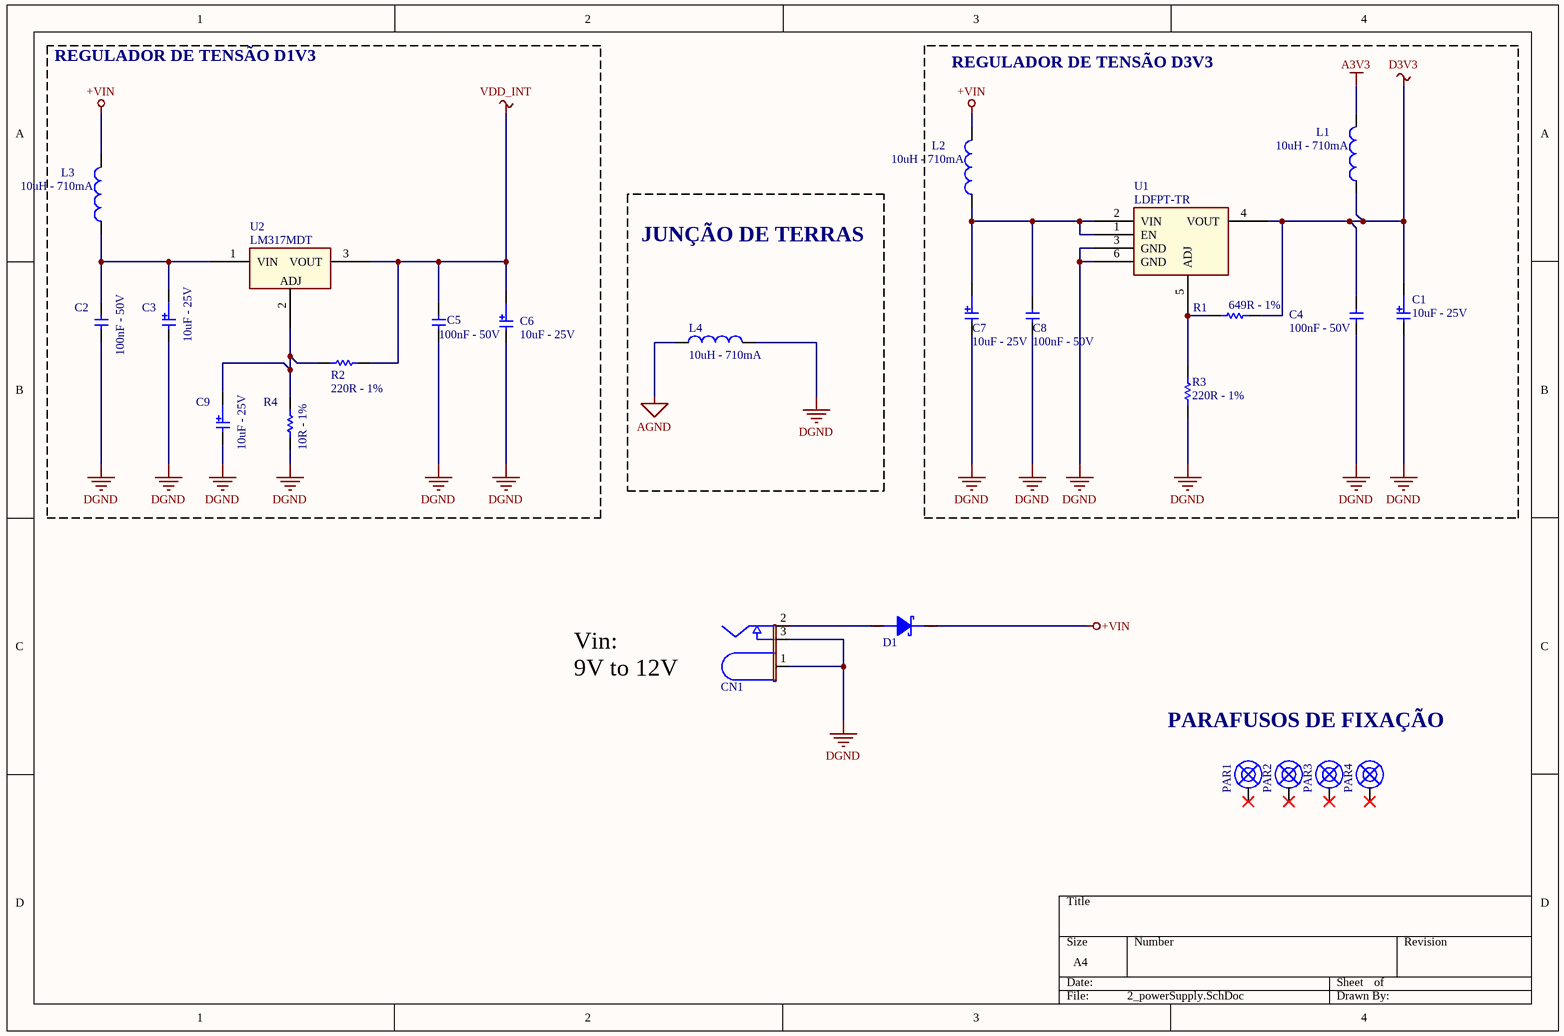
[diagram p7: 2_powerSupply.SchDoc]

### Parts
C1  VALOR: 10uF - 25V  [SMD2412-CAP]  (hidden comment: 10uF - 25V - 10% - SMD2412 - 5430)
C2  VALOR: 100nF - 50V  [SMD0805-CAP]  (hidden comment: Capacitor 100nF - 50V)
C3  VALOR: 10uF - 25V  [SMD2412-CAP]  (hidden comment: 10uF - 25V - 10% - SMD2412 - 5430)
C4  VALOR: 100nF - 50V  [SMD0805-CAP]  (hidden comment: Capacitor 100nF - 50V)
C5  VALOR: 100nF - 50V  [SMD0805-CAP]  (hidden comment: Capacitor 100nF - 50V)
C6  VALOR: 10uF - 25V  [SMD2412-CAP]  (hidden comment: 10uF - 25V - 10% - SMD2412 - 5430)
C7  VALOR: 10uF - 25V  [SMD2412-CAP]  (hidden comment: 10uF - 25V - 10% - SMD2412 - 5430)
C8  VALOR: 100nF - 50V  [SMD0805-CAP]  (hidden comment: Capacitor 100nF - 50V)
C9  VALOR: 10uF - 25V  [SMD2412-CAP]  (hidden comment: 10uF - 25V - 10% - SMD2412 - 5430)
CN1  Conector POWER JACK 2.5MM  [RAPC712X]  (value not drawn)
D1  Diodo B2100-13-F (SMB)  [SMB]  (value not drawn)
L1  VALOR: 10uH - 710mA  [WE-TPC-S]  (hidden comment: Indutor 10uH 710mA SMD)
L2  VALOR: 10uH - 710mA  [WE-TPC-S]  (hidden comment: Indutor 10uH 710mA SMD)
L3  VALOR: 10uH - 710mA  [WE-TPC-S]  (hidden comment: Indutor 10uH 710mA SMD)
L4  VALOR: 10uH - 710mA  [WE-TPC-S]  (hidden comment: Indutor 10uH 710mA SMD)
PAR1  Parafuso M3 - 1295  [FURO/142/240/M4/CHASSI]  (value not drawn)
PAR2  Parafuso M3 - 1295  [FURO/142/240/M4/CHASSI]  (value not drawn)
PAR3  Parafuso M3 - 1295  [FURO/142/240/M4/CHASSI]  (value not drawn)
PAR4  Parafuso M3 - 1295  [FURO/142/240/M4/CHASSI]  (value not drawn)
R1  VALOR: 649R - 1%  [SMD0805]  (hidden comment: 649R- 1% - 0805 - 466)
R2  VALOR: 220R - 1%  [SMD0805]  (hidden comment: 220R - 1% - 0805 - 381)
R3  VALOR: 220R - 1%  [SMD0805]  (hidden comment: 220R - 1% - 0805 - 381)
R4  VALOR: 10R - 1%  [SMD0805]  (hidden comment: 10R - 1% - 0805 - 344)
U1  VALOR: LDFPT-TR  [PPAK-5]  (hidden comment: CI LDFPT-TR)
U2  VALOR: LM317MDT  [TO252]  (hidden comment: LM317MDT (TO252) 713)

### Blocks framed on the sheet
REGULADOR DE TENSÃO D1V3: C2 C3 C5 C6 C9 L3 R2 R4 U2
REGULADOR DE TENSÃO D3V3: C1 C4 C7 C8 L1 L2 R1 R3 U1
JUNÇÃO DE TERRAS: L4

### Nets
+VIN: D1.2(K) L2.2 L3.2
A3V3: L1.2
AGND: L4.1
D3V3: C1.1(+) C4.1 L1.1 R1.2 U1.4(VOUT)
DGND: C1.2(-) C2.2 C3.2(-) C4.2 C5.2 C6.2(-) C7.2(-) C8.2 C9.2(-) CN1.1 CN1.3 L4.2 R3.1 R4.1 U1.3(GND) U1.6(GND)
VDD_INT: C5.1 C6.1(+) R2.2 U2.3(VOUT)
NetC2_1: C2.1 C3.1(+) L3.1 U2.1(VIN)
NetC7_1: C7.1(+) C8.1 L2.1 U1.1(EN) U1.2(VIN)
NetC9_1: C9.1(+) R2.1 R4.2 U2.2(ADJ)
NetCN1_2: CN1.2 D1.1(A)
NetR1_1: R1.1 R3.2 U1.5(ADJ)

Not connected (* = marked no-connect by the designer): PAR1 1*; PAR2 1*; PAR3 1*; PAR4 1*

### Notes on the sheet
- Vin:
  9V to 12V
- PARAFUSOS DE FIXAÇÃO

### Library data of the parts
C1 C3 C6 C7 C9 = 10uF - 25V - 10% - SMD2412 - 5430: Capacitor 10uF, SDM TANTALUM; MANUFACTURER: AVX; PARTNUMBER: TBJC106K025LBSB0024; CODIGO: 5430; DESC: CAP 10uF, 25V, SMD2412, 10%, LOW ESR, TANTALUM; PSpiceTemplate: C^@REFDES %+ %- ?TOLERANCE¦C^@REFDES¦ @VALUE ?IC/IC=@IC/ ?TOLERANCE¦\n.model C^@REFDES CAP C=1 DEV=@TOLERANCE%¦; EMBALAGEM: BULK; FORNECEDOR: MOUSER; ComponentLinK1Description: Datasheet; ComponentLink1URL: http://www.mouser.com/ds/2/40/tbj-12472.pdf; ComponentLink2Description: COMPONENT PAGE; ComponentLink2URL: http://br.mouser.com/ProductDetail/AVX/TBJC106K025LBSB0024/?qs=sGAEpiMZZMuEN2agSAc2pscrdRLVHCGN2%2fr%2fCTD1deQ%3d; ENCAPSULAMENTO: SMD2412; FACTORY PACK: 200; LOCALIZAÇÃO: *; Supplier 1: Mouser; Supplier Part Number 1: 647-UWX1E100MCL1
C2 C4 C5 C8 = Capacitor 100nF - 50V: Capacitor 100nF, SMD 0805; PARTNUMBER: 08055G104ZAT2A; MANUFACTURER: AVX; PSpiceTemplate: C^@REFDES %1 %2 ?TOLERANCE¦C^@REFDES¦ @VALUE ?IC/IC=@IC/ ?TOLERANCE¦\n.model C^@REFDES CAP C=1 DEV=@TOLERANCE%¦; VOLTAGE: CMAX; DESC: CAP 100nF, 50V, SMD0805, Z%, Y5V, CERAMICO MULTICAMADA; CODIGO: 1760; EMBALAGEM: REEL; FORNECEDOR: MOUSER; FOOTPRINT: SMD0805; ComponentLinK1Description: Datasheet; ComponentLink1URL: http://www.mouser.com/ds/2/40/cy5v-5766.pdf; ComponentLink2Description: HOME AVX; ComponentLink2URL: http://www.avx.com/; ENCAPSULAMENTO: SMD0805; FACTORY PACK: 4000; LOCALIZAÇÃO: *; Supplier 1: Mouser; Supplier Part Number 1: 581-08055G104Z
CN1 = CNC POWER JACK 2.5MM - 4414: MANUFACTURER: SWITCHCRAFT; CODIGO: 4414; DESC: CNC PCI, JACK 2.5MM, ALIMENTACAO CC, 90G, 5A, PRETO; FORNECEDOR: MOUSER; EMBALAGEM: BULK; PARTNUMBER: RAPC712X; VALOR: Conector POWER JACK 2.5MM; LOCALIZAÇÃO: *; FACTORY PACK: 2500; ENCAPSULAMENTO: *; ComponentLink2URL: http://www.switchcraft.com; ComponentLink2Description: HOME SWITCHCRAFT; ComponentLink1URL: http://www.switchcraft.com/productsummary.aspx?Parent=581; ComponentLinK1Description: Datasheet; Supplier Part Number 1: 502-RAPC712X; NCM: 8536.90.40
D1 = Diodo B2100-13-F (SMB): MANUFACTURER: DIODES INC; CODE: xxxx; DESC: DIODO SCHOTTKY, 100V, 2A, B2100-13-F, SMB; EMBALAGEM: REEL; FORNCEDOR: MOUSER; PARTNUMBER: B2100-13-F; ComponentLinK1Description: Datasheet; ComponentLink1URL: http://www.mouser.com/ds/2/115/ds30021-83821.pdf; ComponentLink2Description: HOME DIODES INC; ComponentLink2URL: www.diodes.com; ENCAPSULAMENTO: SMB; FACTORY PACK: 3000; LOCALIZAÇÃO: *; VALOR: B2100-13-F; Supplier 1: Mouser; Supplier Part Number 1: 621-B2100-F
L1-L4 = 10uH - 710mA - SMD - 3058: PARTNUMBER: LQH3NPN100NJ0L; MANUFACTURER: MURATA; CODIGO: 3058; DESC: INDUTOR, FIXO SMD, 10uH, 710mA, 30%TOL; EMBALAGEM: REEL; FORNECEDOR: MOUSER; TARGET MÁX U$: $0,1263; ComponentLinK1Description: Datasheet; ComponentLink1URL: http://www.farnell.com/datasheets/1668060.pdf; ComponentLink2Description: HOME MURATA; ComponentLink2URL: www.murata.com; ENCAPSULAMENTO: WE-TPC-S; FACTORY PACK: 1000; LOCALIZAÇÃO: *; Supplier Part Number 1: 81-LQH3NPN100NJ0L; NCM: 8504.50.00
PAR1-PAR4 = Parafuso M3 - 1295: Parafuso M3; CODIGO: 1295; ENCAPSULAMENTO: PTH; DESC: PARAFUSO M3; VALOR: Parafuso M3; ComponentLinK1Description: Datasheet; ComponentLink1URL: *; ComponentLink2Description: *; ComponentLink2URL: *; EMBALAGEM: *; FACTORY PACK: *; FORNECEDOR: *; LOCALIZAÇÃO: *; MANUFACTURER: *; PARTNUMBER: *; NCM: 7318.15.00
R1 = 649R - 1% - 0805 - 466: Resistor 649R, 1%, SMD 0805; PARTNUMBER: RC2012F6490CS; MANUFACTURER: SAMSUNG; CODIGO: 466; EMBALAGEM: REEL; FORNECEDOR: VARIOS; DESC: RES 6K49, 1%, SMD 0805, MF; TARGET MÁX U$: $0.0015; LOCALIZAÇÃO: *; ENCAPSULAMENTO: SMD0805; FACTORY PACK: 5000; Supplier 1: Digi-Key; Supplier Part Number 1: RC2012F6490CS; ComponentLink1Description: Datasheet; ComponentLink1URL: http://media.digikey.com/pdf/Data%20Sheets/Samsung%20PDFs/CHIP_RESISTOR_Catalog.pdf; ComponentLink2Description: HOME SANSUNG; ComponentLink2URL: http://www.samsung.com/global/business/semiconductor/; NCM: 8533.21.20
R2 R3 = 220R - 1% - 0805 - 381: Resistor 220R, 1%, SMD 0805; PARTNUMBER: ERJ-6ENF2200V; MANUFACTURER: SAMSUNG; CODIGO: 381; EMBALAGEM: REEL; FORNECEDOR: VARIOS; DESC: RES 220R, 1%, SMD 0805, MF; TARGET MÁX U$: $0.0015; LOCALIZAÇÃO: *; ENCAPSULAMENTO: SMD0805; FACTORY PACK: 5000; ComponentLink1Description: Datasheet; ComponentLink1URL: http://avnetexpress.avnet.com/store/em/EMController/_/A-5002847221649/An-0?action=part&catalogId=500201&langId=-1&storeId=500201&CMP=KNC-SupplyFrame_VSE-T11; ComponentLink2URL: http://www.samsung.com/global/business/semiconductor/; Supplier 1: AVNET; NCM: 8533.21.20
  R2: ComponentLink2Description: HOME SAMSUNG; Supplier Part Number 1: RC2012F2200V
  R3: ComponentLink2Description: HOME SANSUNG; Supplier Part Number 1: RC2012F2400CS
R4 = 10R - 1% - 0805 - 344: Resistor 10R, 1%, SMD 0805; PARTNUMBER: RC2012F10R0CS; MANUFACTURER: SANSUNG; CODIGO: 344; EMBALAGEM: REEL; FORNECEDOR: VARIOS; DESC: RES 10R, 1%, SMD 0805, MF; TARGET MÁX U$: $0.0015; LOCALIZAÇÃO: *; ENCAPSULAMENTO: SMD0805; FACTORY PACK: 5000; ComponentLink1Description: Datasheet; ComponentLink1URL: http://download.siliconexpert.com/pdfs/2012/12/5/3/46/2/282/samelm_/manual/rcseries1.pdf; ComponentLink2Description: HOME SANSUNG; ComponentLink2URL: http://www.samsung.com/global/business/semiconductor/; Supplier 1: Arrow; Supplier Part Number 1: 51841909S9970589N4139; NCM: 8533.21.20
U1 = CI LDFPT-TR: MANUFACTURER: ST MICROELETRONICS; CODIGO: 5218; DESC: CI, LDFPT-TR, 1 A VERY LOW DROP VOLTAGE REGULATOR, PPAK; EMBALAGEM: REEL; FORNECEDOR: VARIOS; ComponentLinK1Description: Datasheet; ComponentLink1URL: http://www.st.com/st-web-ui/static/active/en/resource/technical/document/datasheet/DM00099995.pdf; ComponentLink2Description: HOME ST; ComponentLink2URL: http://www.st.com/web/en/home.html; ENCAPSULAMENTO: PPAK-5; FACTORY PACK: 2500; LOCALIZAÇÃO: *; PARTNUMBER: LDFPT-TR; Supplier Part Number 1: LDFPT-TR; Supplier 1: AVNET
U2 = LM317MDT (TO252) 713: CI LM317MDT; MANUFACTURER: NATIONAL; DESC: LM317, 3 TERMINAL AJUSTABLE REGULATOR, TO252-DPACK; CODIGO: 713; FORNECEDOR: MOUSER; ENCAPSULAMENTO: SMD/SMT - TO-252; EMBALAGEM: REEL; PARTNUMBER: LM317MDT; LOCALIZAÇÃO: *; FACTORY PACK: 2500; ComponentLink2URL: http://www.st.com/web/en/home.html; ComponentLink2Description: HOME ST; ComponentLink1URL: http://www.st.com/web/en/resource/technical/document/datasheet/CD00000549.pdf; ComponentLinK1Description: Datasheet; Supplier 1: Mouser; Supplier Part Number 1: 511-LM317MDT

## Nets that join several sheets
+VIN: 9_arduinoConnectors (CN6.8), 3_audioConnectors (J2.13 J2.14), 2_powerSupply (D1.2 L2.2 L3.2)
A3V3: 6_audioCodec (U6.5), 3_audioConnectors (J2.5 J2.6), 2_powerSupply (L1.2)
AGND: 6_audioCodec (C33.1 U6.7), 3_audioConnectors (6 pins), 2_powerSupply (L4.1)
D3V3: 4_DspBlackfin (27 pins), 5_spiFlash (5 pins), 8_oledDisplay (C36.1 R27.2 R28.2 U7.3), 6_audioCodec (5 pins), 2_powerSupply (5 pins)
DGND: 4_DspBlackfin (32 pins), 5_spiFlash (C32.2 R26.1 U5.4), 8_oledDisplay (C36.2 U7.4), 9_arduinoConnectors (CN6.6 CN6.7 R29.2), 6_audioCodec (5 pins), 3_audioConnectors (J2.1 J2.2), 2_powerSupply (16 pins)
VDD_INT: 4_DspBlackfin (13 pins), 2_powerSupply (C5.1 C6.1 R2.2 U2.3)
LLINEIN: 6_audioCodec (U6.14), 3_audioConnectors (C10.1 J2.7)
LLINEOUT: 6_audioCodec (U6.12), 3_audioConnectors (C11.2 J2.11)
NetC14_2: 6_audioCodec (U6.15), 3_audioConnectors (C14.2 R5.1)
NetC15_2: 6_audioCodec (U6.16), 3_audioConnectors (C15.2 R5.2)
NetCN4_1: 6_audioCodec (U6.4), 3_audioConnectors (CN4.1)
NetCN4_3: 6_audioCodec (U6.2), 3_audioConnectors (CN4.3)
NetCN4_5: 6_audioCodec (U6.6), 3_audioConnectors (CN4.5)
NetCN7_3: 4_DspBlackfin (U3.50), 9_arduinoConnectors (CN7.3)
NetCN7_4: 4_DspBlackfin (U3.49), 9_arduinoConnectors (CN7.4)
NetCN7_5: 4_DspBlackfin (U3.39), 9_arduinoConnectors (CN7.5)
NetCN8_1: 4_DspBlackfin (R11.1 U3.36), 9_arduinoConnectors (CN8.1)
NetP2_1: 4_DspBlackfin (U3.60), 8_oledDisplay (R27.1 U7.2), 9_arduinoConnectors (P2.1)
NetP2_2: 4_DspBlackfin (U3.59), 8_oledDisplay (R28.1 U7.1), 9_arduinoConnectors (P2.2)
NetP2_5: 4_DspBlackfin (U3.42), 9_arduinoConnectors (P2.5), 6_audioCodec (U6.29)
NetP2_6: 4_DspBlackfin (R14.1 U3.44), 9_arduinoConnectors (P2.6)
NetP2_7: 4_DspBlackfin (U3.43), 9_arduinoConnectors (P2.7), 6_audioCodec (U6.27)
NetP2_8: 4_DspBlackfin (U3.47), 9_arduinoConnectors (P2.8)
NetP2_9: 4_DspBlackfin (U3.45), 9_arduinoConnectors (P2.9)
NetP2_10: 4_DspBlackfin (U3.48), 9_arduinoConnectors (P2.10)
NetR8_2: 4_DspBlackfin (R8.2), 6_audioCodec (U6.21)
NetR21_1: 4_DspBlackfin (R21.1 SW1.3 SW1.4 U4.3), 9_arduinoConnectors (R30.1)
NetR24_1: 4_DspBlackfin (U3.17), 5_spiFlash (R24.1 U5.2)
NetR25_1: 4_DspBlackfin (U3.10), 5_spiFlash (R25.1 U5.1)
NetR26_2: 4_DspBlackfin (U3.18), 5_spiFlash (R26.2 U5.6)
NetR31_2: 4_DspBlackfin (U3.15), 9_arduinoConnectors (R31.2)
NetR32_2: 4_DspBlackfin (U3.13), 9_arduinoConnectors (R32.2)
NetU3_1: 4_DspBlackfin (U3.1 U3.6), 6_audioCodec (U6.24)
NetU3_2: 4_DspBlackfin (U3.2), 6_audioCodec (U6.23)
NetU3_5: 4_DspBlackfin (U3.5), 6_audioCodec (U6.26)
NetU3_11: 4_DspBlackfin (U3.11), 6_audioCodec (U6.31)
NetU3_16: 4_DspBlackfin (U3.16), 5_spiFlash (U5.5)
NetU3_64: 4_DspBlackfin (U3.64), 6_audioCodec (U6.25)
RLINEIN: 6_audioCodec (U6.13), 3_audioConnectors (C12.1 J2.8)
RLINEOUT: 6_audioCodec (U6.11), 3_audioConnectors (C13.2 J2.12)